# EAGLE design Theremizer (EAGLE 9.5.1)

## Sheet 1 of 3
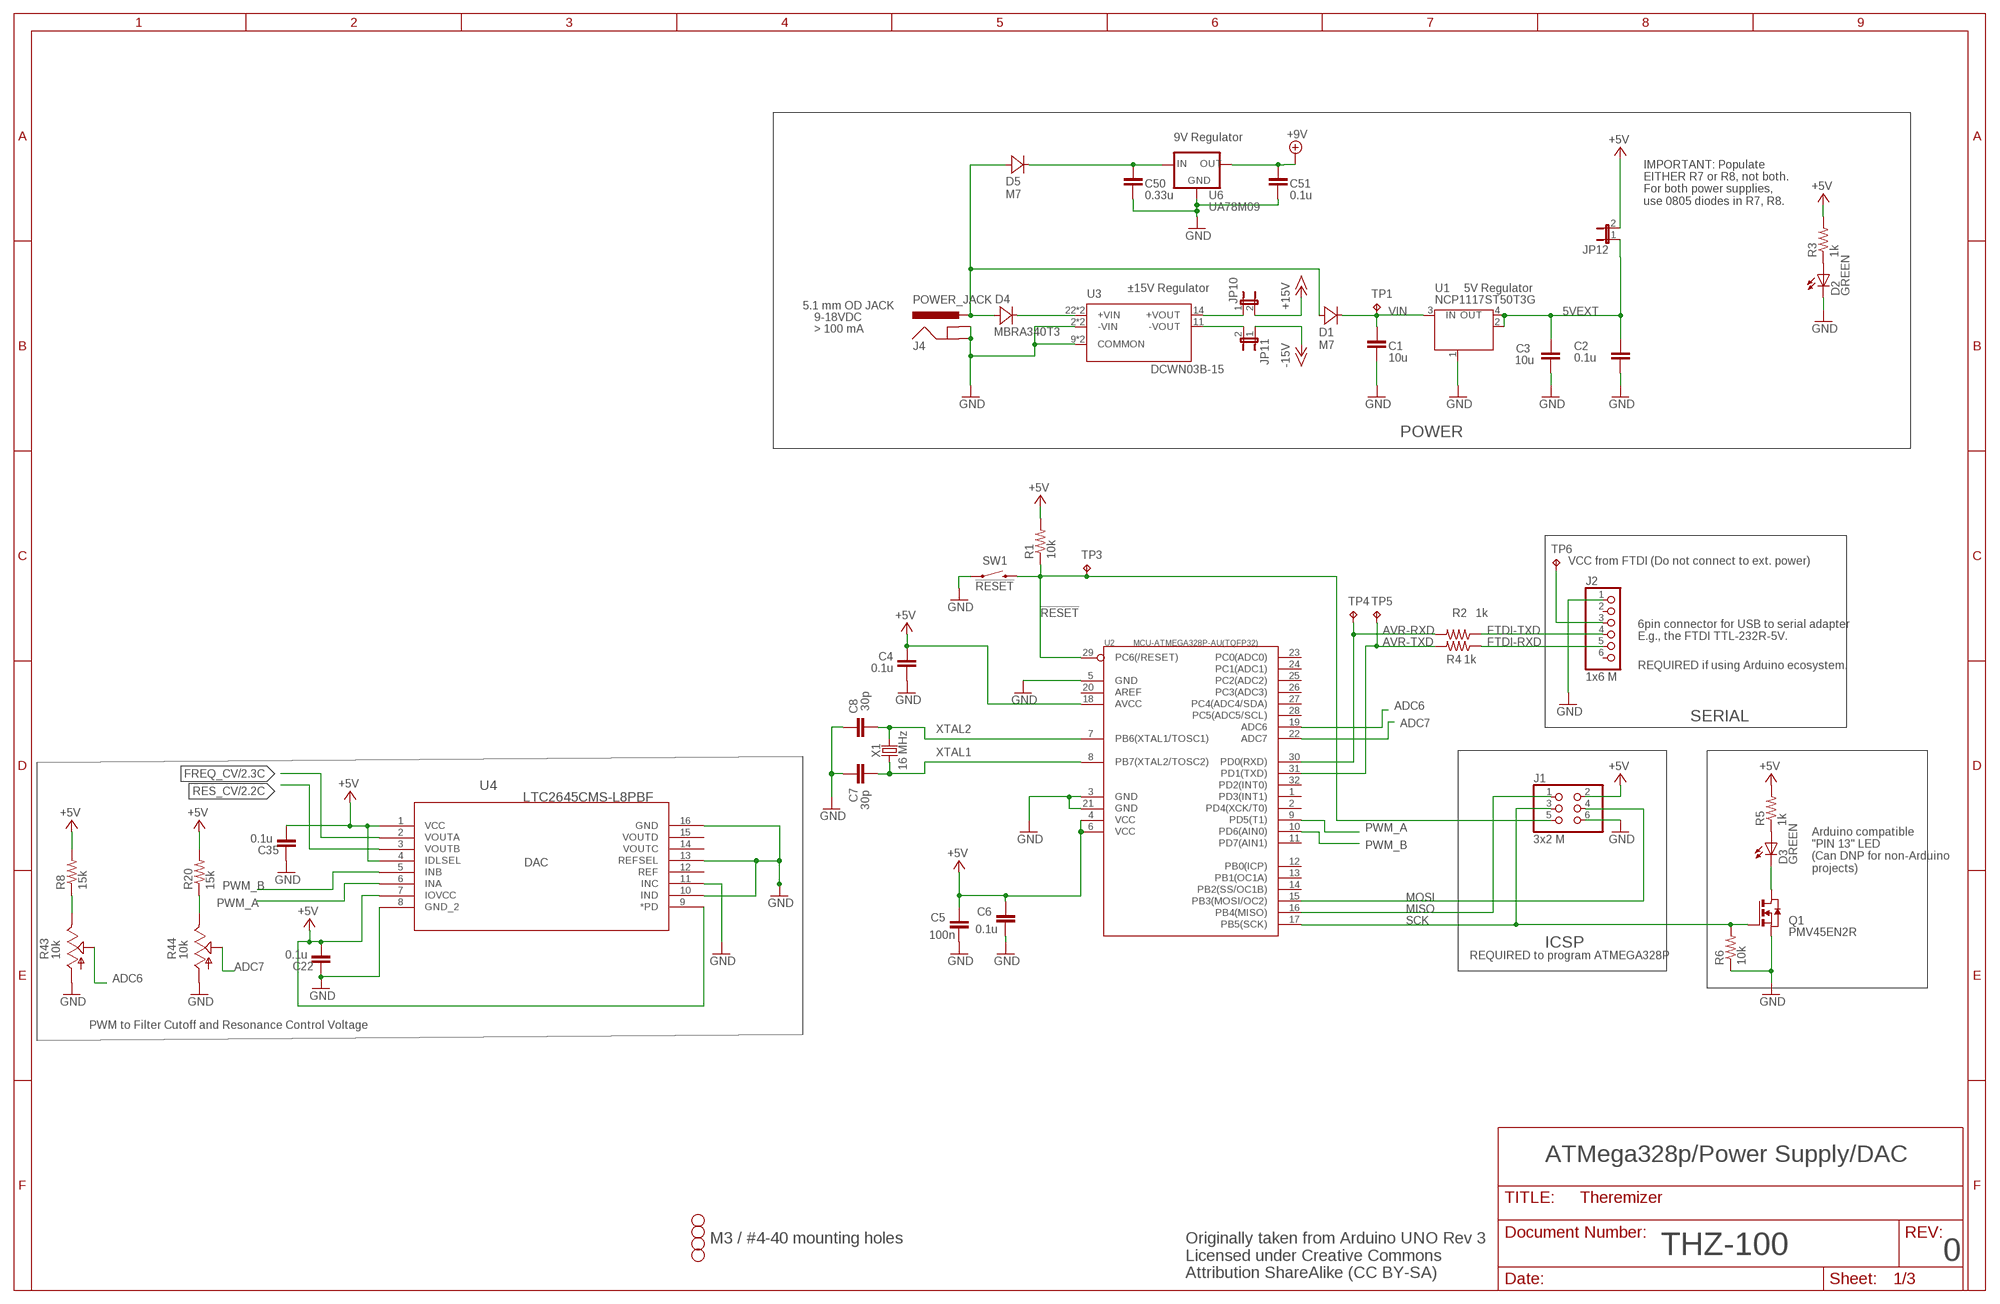
[diagram p0: schematic, sheet 1]

### Parts
C1  10u  C-EUC0805  [C0805]
C2  0.1u  C-EUC0805  [C0805]
C3  10u  C-EUC0805  [C0805]
C4  0.1u  C-EUC0805  [C0805]
C5  100n  C-EUC0805  [C0805]
C6  0.1u  C-EUC0805  [C0805]
C7  30p  C-EUC0805  [C0805]
C8  30p  C-EUC0805  [C0805]
C22  0.1u  C-EUC0805K  [C0805K]
C35  0.1u  C-EUC0805  [C0805]
C50  0.33u  C-EUC0805  [C0805]
C51  0.1u  C-EUC0805  [C0805]
D1  M7  MBRA340T3  [SMA]
D2  GREEN  LEDCHIP-LED0805  [CHIP-LED0805]
D3  GREEN  LEDCHIP-LED0805  [CHIP-LED0805]
D4  MBRA340T3  [SMA]
D5  M7  MBRA340T3  [SMA]
H1  STAND-OFF  [STAND-OFF]
H2  STAND-OFF  [STAND-OFF]
H3  STAND-OFF  [STAND-OFF]
H4  STAND-OFF  [STAND-OFF]
J1  3x2 M  PINHD-2X3  [2X03]
J2  1x6 M  PINHD-1X6  [1X06]
J4  POWER_JACK  [POWER_JACK_PTH]
JP10  JP1E  [JP1]
JP11  JP1E  [JP1]
JP12  JP1E  [JP1]
Q1  PMV45EN2R  NMOSSOT23  [SOT-23]
R1  10k  R-US_R0805  [R0805]
R2  1k  R-US_R0805  [R0805]
R3  1k  R-US_R0805  [R0805]
R4  1k  R-US_R0805  [R0805]
R5  1k  R-US_R0805  [R0805]
R6  10k  R-US_R0805  [R0805]
R8  15k  R-US_R0805  [R0805]
R20  15k  R-US_R0805  [R0805]
R43  10k  TRIM_US-B64Y  [B64Y]
R44  10k  TRIM_US-B64Y  [B64Y]
SW1  !RESET  SWITCH-MOMENTARY-2SMD  [TACTILE_SWITCH_SMD]
TP1  TPPAD1-13  [P1-13]
TP3  TPPAD1-13  [P1-13]
TP4  TPPAD1-13  [P1-13]
TP5  TPPAD1-13  [P1-13]
TP6  TPPAD1-13  [P1-13]
U1  NCP1117ST50T3G  MC33269ST-3.3T3  [SOT223]
U2  MCU-ATMEGA328P-AU(TQFP32)  [TQFP32-0.8-7X7MM]
U3  DCWN03B-15  DCWN03  [DIP1549W45P254L3404H940Q24]
U4  LTC2645CMS-L8PBF  [MSOP-16_MS]
U6  UA78M09  µA78MX  [DPACK]
X1  16 MHz  CRYSTALSMD-HC49UP  [HC49UP]

### Nets
5VEXT [power]: C2.2 C3.1 JP12.1 U1.2(OUT) U1.4(OUT)
!RESET: J1.5 R1.1 SW1.3 TP3.TP U2.29(PC6(/RESET))
+5V [power]: C4.2 C5.2 C6.2 C22.1 C35.1 J1.2 JP12.2 R1.2 R3.2 R5.2 R8.2 R20.2 U2.4(VCC) U2.6(VCC) U2.18(AVCC) U4.1(VCC) U4.4(IDLSEL) U4.7(IOVCC) U4.9(*PD) ; also sheet 2
+9V [power]: C51.1 U6.3(OUT) ; also sheet 3
+15V [power]: JP10.2 ; also sheet 2
-15V [power]: JP11.1 ; also sheet 2
ADC6: R43.S U2.19(ADC6)
ADC7: R44.S U2.22(ADC7)
AVR-RXD: R2.2 TP4.TP U2.30(PD0(RXD))
AVR-TXD: R4.2 TP5.TP U2.31(PD1(TXD))
FREQ_CV: U4.2(VOUTA) ; also sheet 2
FTDI-RXD: J2.5 R4.1
FTDI-TXD: J2.4 R2.1
GND [power]: C1.2 C2.1 C3.2 C4.1 C5.1 C6.1 C7.2 C8.2 C22.2 C35.2 C50.2 C51.2 D2.C J1.6 J2.1 J4.GND J4.GNDBREAK Q1.2(S) R6.1 R43.A R44.A SW1.1 U1.1(GND/ADJ) U2.3(GND) U2.5(GND) U2.21(GND) U3.2(-VIN) U3.3(-VIN) U3.9(COMMON) U3.16(COMMON) U4.8(GND_2) U4.10(IND) U4.11(INC) U4.13(REFSEL) U4.16(GND) U6.4(GND) ; also sheet 2,3
MISO: J1.1 U2.16(PB4(MISO))
MOSI: J1.4 U2.15(PB3(MOSI/OC2))
N$2: D3.A R5.1
N$3 [power]: D2.A R3.1
N$4: D3.C Q1.1(D)
N$5: J2.3 TP6.TP
N$47 [power]: C50.1 D5.C U6.1(IN)
N$51 [power]: D1.A D4.A D5.A J4.PWR
N$54 [power]: D4.C U3.22(+VIN) U3.23(+VIN)
N$55 [power]: JP10.1 U3.14(+VOUT)
N$56 [power]: JP11.2 U3.11(-VOUT)
N$77: R8.1 R43.E
N$78: R20.1 R44.E
PWM_A: U2.9(PD5(T1)) U4.6(INA)
PWM_B: U2.10(PD6(AIN0)) U4.5(INB)
RES_CV: U4.3(VOUTB) ; also sheet 2
SCK: J1.3 Q1.3(G) R6.2 U2.17(PB5(SCK))
VIN [power]: C1.1 D1.C TP1.TP U1.3(IN)
XTAL1: C7.1 U2.8(PB7(XTAL2/TOSC2)) X1.1
XTAL2: C8.1 U2.7(PB6(XTAL1/TOSC1)) X1.2
Unconnected: J2.2 J2.6 U2.1(PD3(INT1)) U2.2(PD4(XCK/T0)) U2.11(PD7(AIN1)) U2.12(PB0(ICP)) U2.13(PB1(OC1A)) U2.14(PB2(SS/OC1B)) U2.20(AREF) U2.23(PC0(ADC0)) U2.24(PC1(ADC1)) U2.25(PC2(ADC2)) U2.26(PC3(ADC3)) U2.27(PC4(ADC4/SDA)) U2.28(PC5(ADC5/SCL)) U2.32(PD2(INT0)) U4.12(REF) U4.14(VOUTC) U4.15(VOUTD)

### Notes on the sheet
- 9V Regulator
- IMPORTANT: Populate 
  EITHER R7 or R8, not both.
  For both power supplies,
  use 0805 diodes in R7, R8.
- ±15V Regulator | 5V Regulator
- 5.1 mm OD JACK
- 9-18VDC
- > 100 mA
- POWER
- VCC from FTDI (Do not connect to ext. power)
- 6pin connector for USB to serial adapter
  E.g., the FTDI TTL-232R-5V.
- REQUIRED if using Arduino ecosystem.
- SERIAL
- DAC
- Arduino compatible
  "PIN 13" LED
  (Can DNP for non-Arduino
  projects)
- ICSP
- REQUIRED to program ATMEGA328P
- PWM to Filter Cutoff and Resonance Control Voltage
- ATMega328p/Power Supply/DAC
- M3 / #4-40 mounting holes
- THZ-100 | 0
- Originally taken from Arduino UNO Rev 3
  Licensed under Creative Commons 
  Attribution ShareAlike (CC BY-SA)

## Sheet 2 of 3
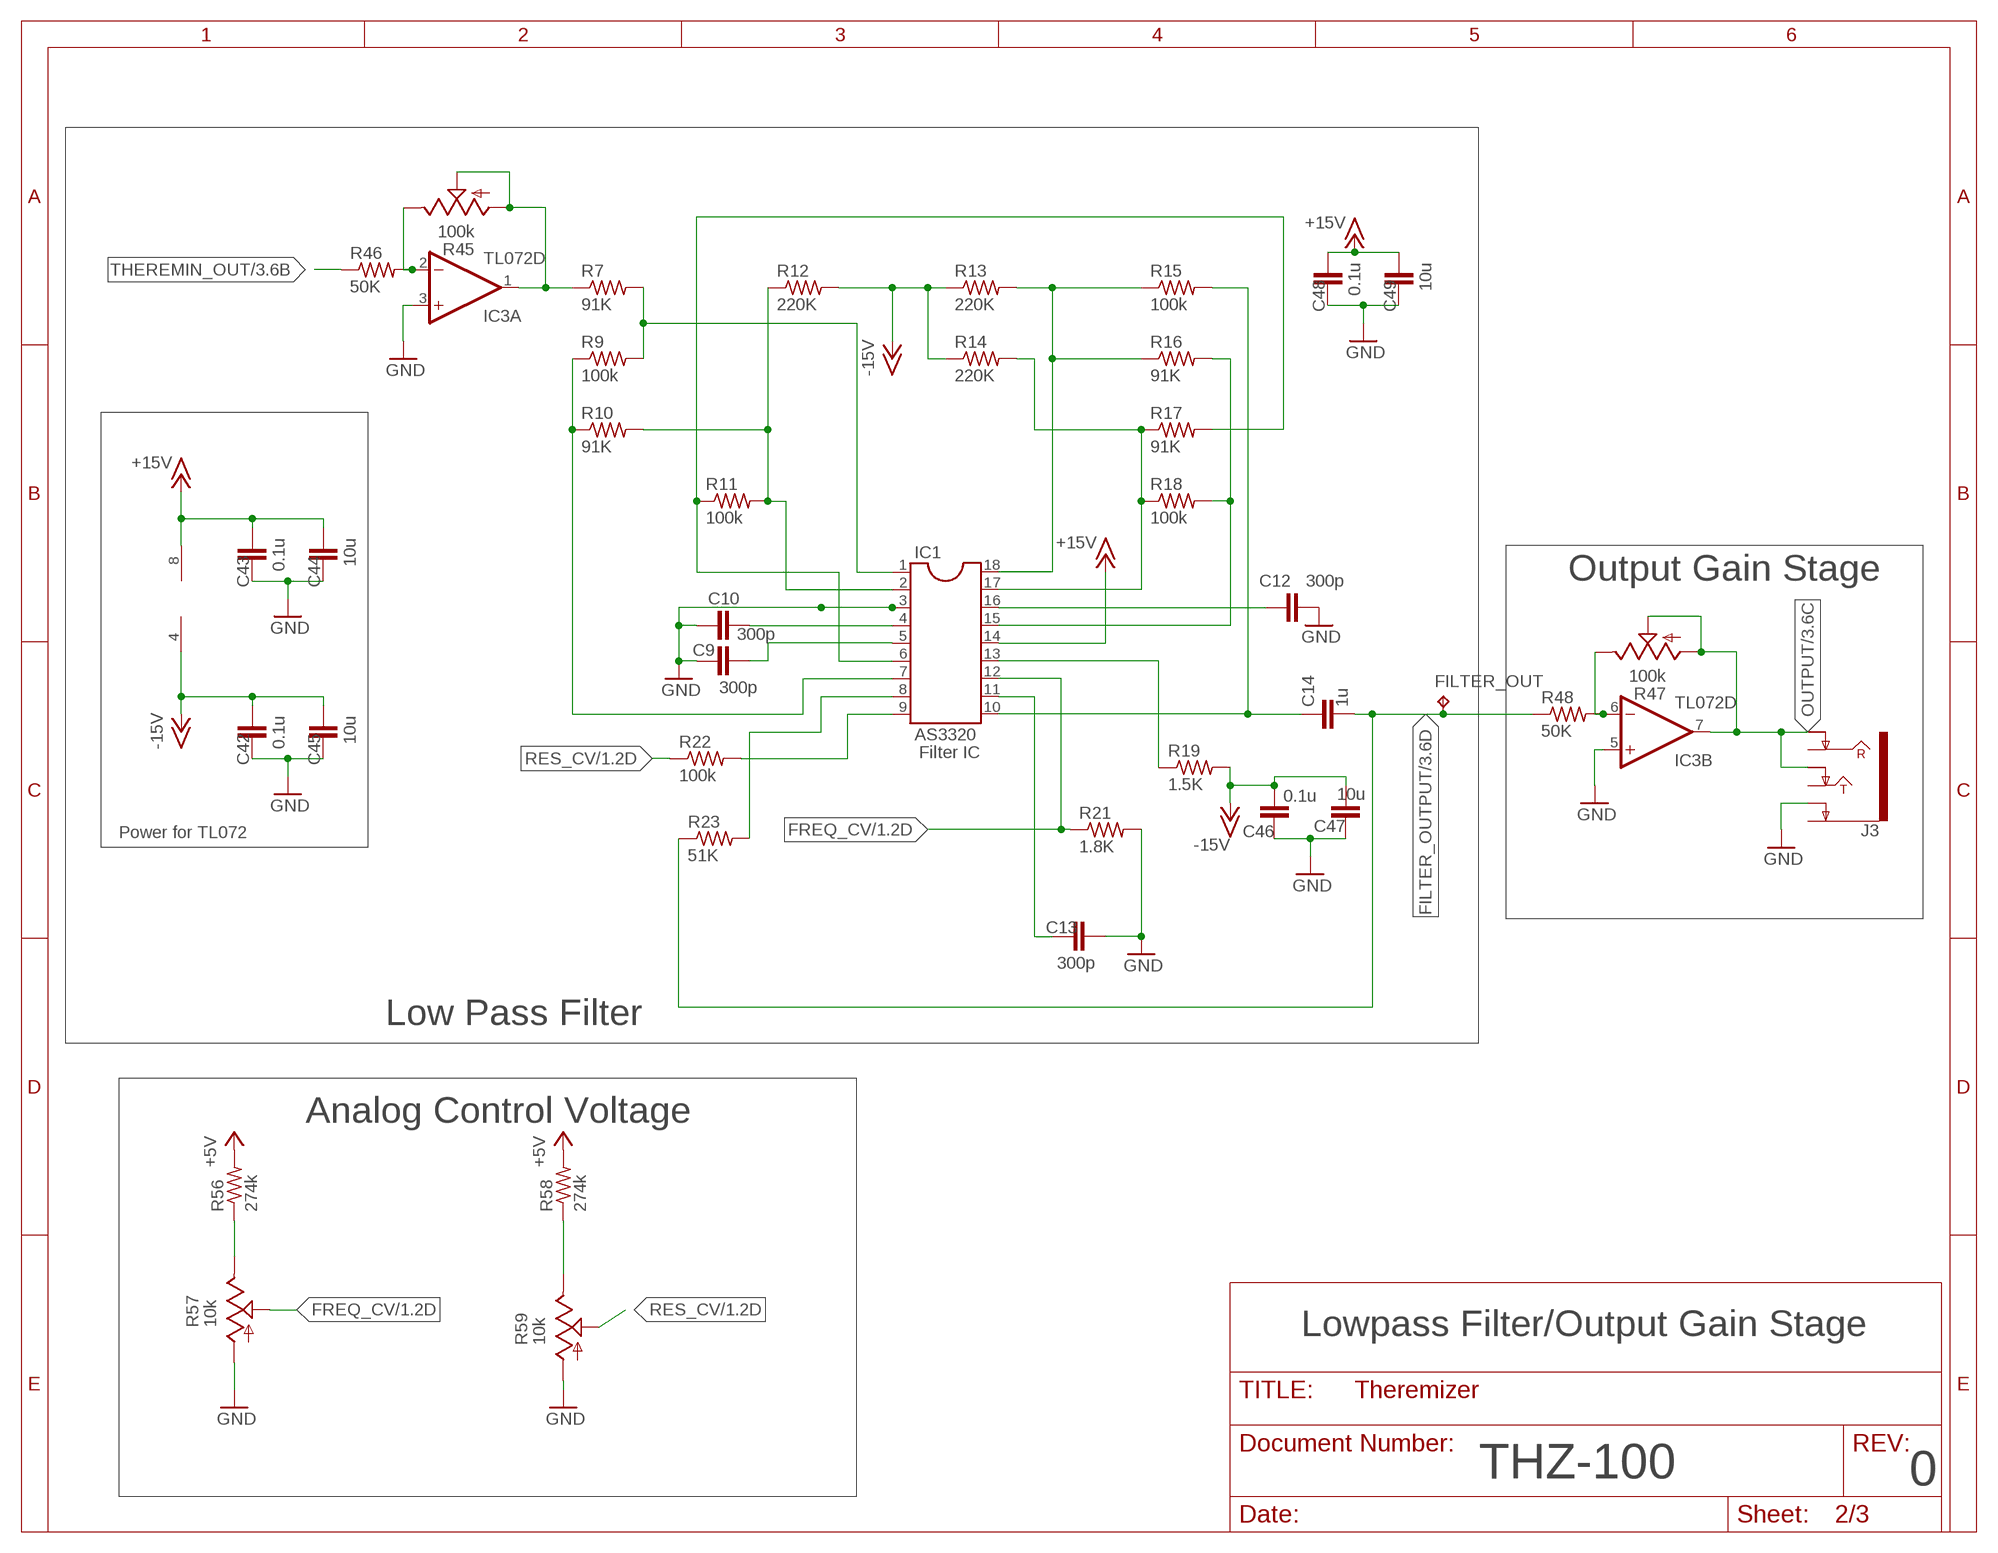
[diagram p1: schematic, sheet 2]

### Parts
C9  300p  C-EUC0805  [C0805]
C10  300p  C-EUC0805  [C0805]
C12  300p  C-EUC0805  [C0805]
C13  300p  C-EUC0805  [C0805]
C14  1u  C-EUC0805  [C0805]
C42  0.1u  C-EUC0805  [C0805]
C43  0.1u  C-EUC0805  [C0805]
C44  10u  C-EUC0805  [C0805]
C45  10u  C-EUC0805  [C0805]
C46  0.1u  C-EUC0805  [C0805]
C47  10u  C-EUC0805  [C0805]
C48  0.1u  C-EUC0805  [C0805]
C49  10u  C-EUC0805  [C0805]
FILTER_OUT  TPB2,54  [B2,54]
IC1  AS3320  DIL18S  [SOCKET-18]
IC3  TL072D  [SO08]
J3  AUDIO_JACK_TRS_0.25"_PTH_RA  [AUDIO_JACK_0.25"_TRS_PTH_RA]
R7  91K  R-US_R0805  [R0805]
R9  100k  R-US_R0805  [R0805]
R10  91K  R-US_R0805  [R0805]
R11  100k  R-US_R0805  [R0805]
R12  220K  R-US_R0805  [R0805]
R13  220K  R-US_R0805  [R0805]
R14  220K  R-US_R0805  [R0805]
R15  100k  R-US_R0805  [R0805]
R16  91K  R-US_R0805  [R0805]
R17  91K  R-US_R0805  [R0805]
R18  100k  R-US_R0805  [R0805]
R19  1.5K  R-US_R0805  [R0805]
R21  1.8K  R-US_R0805  [R0805]
R22  100k  R-US_R0805  [R0805]
R23  51K  R-US_R0805  [R0805]
R45  100k  TRIM_US-B64Y  [B64Y]
R46  50K  R-US_R0805  [R0805]
R47  100k  TRIM_US-B64Y  [B64Y]
R48  50K  R-US_R0805  [R0805]
R56  274k  R-US_R0805  [R0805]
R57  10k  TRIM_US-B64Y  [B64Y]
R58  274k  R-US_R0805  [R0805]
R59  10k  TRIM_US-B64Y  [B64Y]

### Nets
+5V [power]: R56.2 R58.2 ; also sheet 1
+15V [power]: C43.2 C44.2 C48.2 C49.2 IC1.14 IC3.8(P:V+) ; also sheet 1
-15V [power]: C42.2 C45.2 C46.2 C47.2 IC3.4(P:V-) R12.2 R13.1 R14.1 R19.2 ; also sheet 1
FILTER_OUTPUT: C14.2 FILTER_OUT.TP R23.1 R48.1 ; also sheet 3
FREQ_CV: IC1.12 R21.1 R57.S ; also sheet 1
GND [power]: C9.1 C10.1 C12.2 C13.2 C42.1 C43.1 C44.1 C45.1 C46.1 C47.1 C48.1 C49.1 IC1.3 IC3.3(A:+IN) IC3.5(B:+IN) J3.SLEEVE-NORM(EARTH-NORM) R21.2 R57.A R59.A ; also sheet 1,3
N$6: IC1.1 R7.2 R9.2
N$7: IC1.7 R9.1 R10.1
N$8: C9.2 IC1.5
N$9: C10.2 IC1.4
N$10: IC1.2 R10.2 R11.2 R12.1
N$11: IC1.6 R11.1 R17.2
N$12: C14.1 IC1.10 R15.2
N$13: IC1.18 R13.2 R15.1 R16.1
N$14: IC1.17 R14.2 R17.1 R18.1
N$15: IC1.15 R16.2 R18.2
N$16: C12.1 IC1.16
N$17: IC1.13 R19.1
N$18: C13.1 IC1.11
N$19: IC3.2(A:-IN) R45.E R46.2
N$20: IC1.8 R23.2
N$21: IC1.9 R22.2
N$32: R56.1 R57.E
N$50: IC3.1(A:OUT) R7.1 R45.A R45.S
N$52: IC3.6(B:-IN) R47.E R48.2
N$65: R58.1 R59.E
OUTPUT: IC3.7(B:OUT) J3.RING-NORM J3.TIP-NORM R47.A R47.S ; also sheet 3
RES_CV: R22.1 R59.S ; also sheet 1
THEREMIN_OUT: R46.1 ; also sheet 3
Unconnected: J3.RING J3.SLEEVE(EARTH) J3.TIP

### Notes on the sheet
- Output Gain Stage
- Filter IC
- Power for TL072
- Low Pass Filter
- Analog Control Voltage
- Lowpass Filter/Output Gain Stage
- THZ-100 | 0

## Sheet 3 of 3
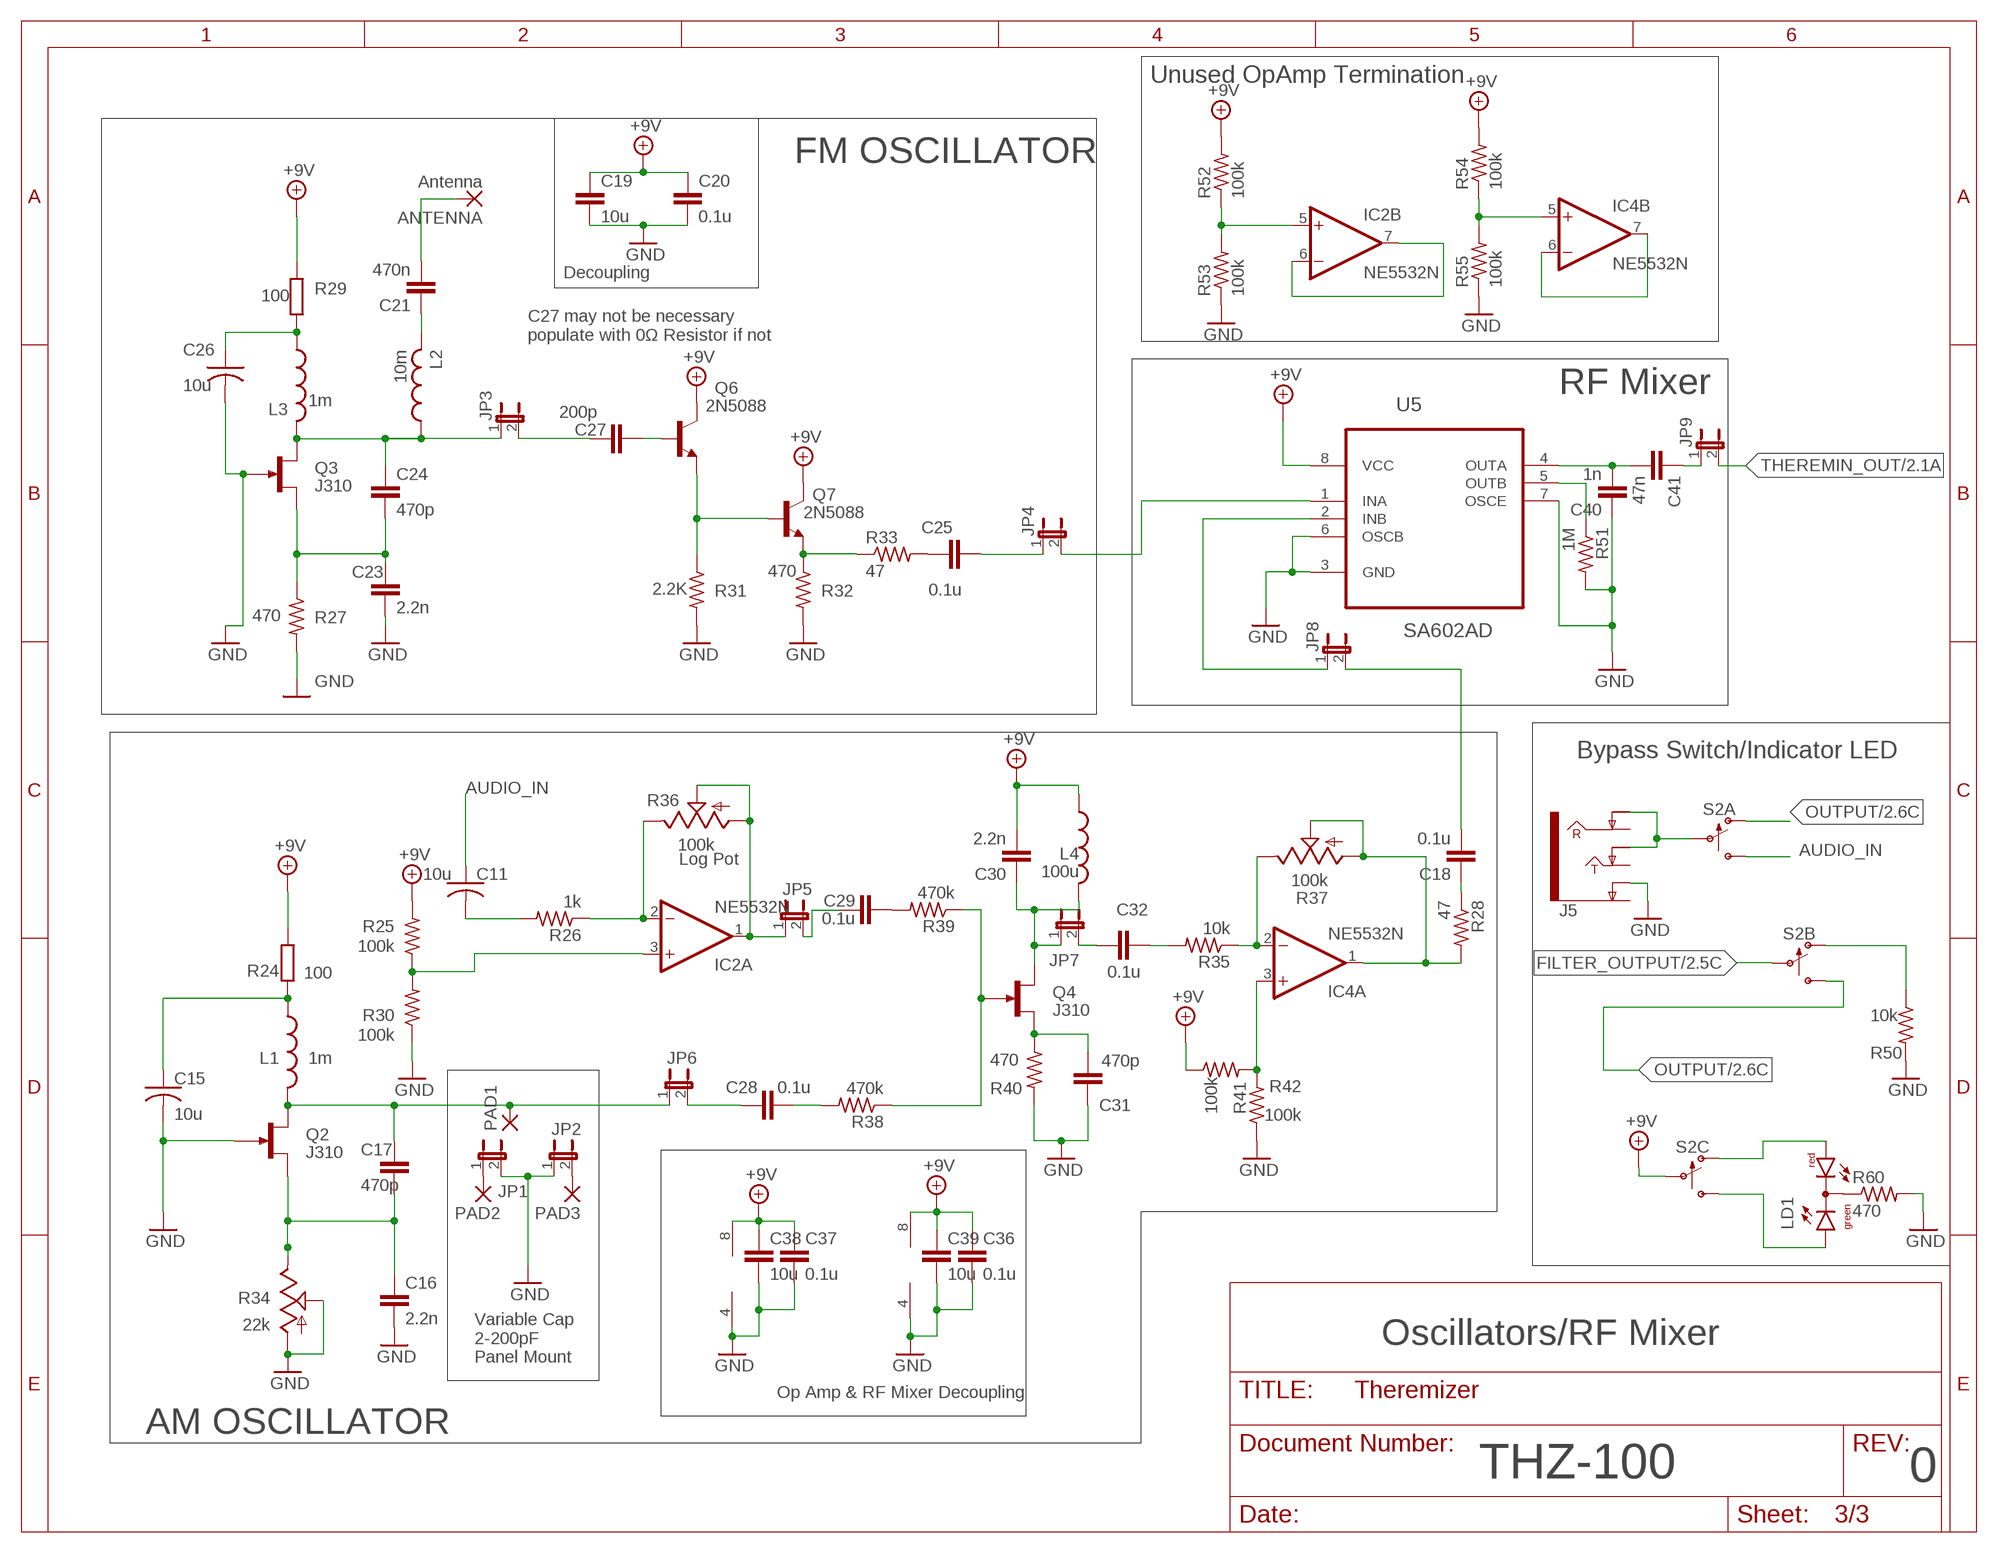
[diagram p2: schematic, sheet 3]

### Parts
ANTENNA  Antenna  2,54/1,1  [2,54/1,1]
C11  10u  C-US050-025X075  [C050-025X075]
C15  10u  C-US050-025X075  [C050-025X075]
C16  2.2n  C-EUC0805  [C0805]
C17  470p  C-EUC0805  [C0805]
C18  0.1u  C-EUC0805  [C0805]
C19  10u  C-EUC0805  [C0805]
C20  0.1u  C-EUC0805  [C0805]
C21  470n  C-EUC0805  [C0805]
C23  2.2n  C-EUC0805  [C0805]
C24  470p  C-EUC0805  [C0805]
C25  0.1u  C-EUC0805  [C0805]
C26  10u  C-US050-025X075  [C050-025X075]
C27  200p  C-EUC0805  [C0805]
C28  0.1u  C-EUC0805  [C0805]
C29  0.1u  C-EUC0805  [C0805]
C30  2.2n  C-EUC0805  [C0805]
C31  470p  C-EUC0805  [C0805]
C32  0.1u  C-EUC0805  [C0805]
C36  0.1u  C-EUC0805  [C0805]
C37  0.1u  C-EUC0805  [C0805]
C38  10u  C-EUC0805  [C0805]
C39  10u  C-EUC0805  [C0805]
C40  1n  C-EUC0805  [C0805]
C41  47n  C-EUC0805  [C0805]
IC2  NE5532N  [DIL08]
IC4  NE5532N  [DIL08]
J5  AUDIO_JACK_TRS_0.25"_PTH_RA  [AUDIO_JACK_0.25"_TRS_PTH_RA]
JP1  JP1E  [JP1]
JP2  JP1E  [JP1]
JP3  JP1E  [JP1]
JP4  JP1E  [JP1]
JP5  JP1E  [JP1]
JP6  JP1E  [JP1]
JP7  JP1E  [JP1]
JP8  JP1E  [JP1]
JP9  JP1E  [JP1]
L1  1m  L-US6000-XXX-RC  [6000-XXXX-RC]
L2  10m  L-US6000-XXX-RC  [6000-XXXX-RC]
L3  1m  L-US6000-XXX-RC  [6000-XXXX-RC]
L4  100u  L-US6000-XXX-RC  [6000-XXXX-RC]
LD1  DUOLED-RG-C  [DUOLED-C-5MM]
PAD1  2,15/1,0  [2,15/1,0]
PAD2  2,15/1,0  [2,15/1,0]
PAD3  2,15/1,0  [2,15/1,0]
Q2  J310  [TO92R]
Q3  J310  [TO92R]
Q4  J310  [TO92R]
Q6  2N5088  [TO92]
Q7  2N5088  [TO92]
R24  100  R-EU_PRL1632  [PRL1632]
R25  100k  R-US_R0805  [R0805]
R26  1k  R-US_R0805  [R0805]
R27  470  R-US_R0805  [R0805]
R28  47  R-US_R0805  [R0805]
R29  100  R-EU_PRL1632  [PRL1632]
R30  100k  R-US_R0805  [R0805]
R31  2.2K  R-US_R0805  [R0805]
R32  470  R-US_R0805  [R0805]
R33  47  R-US_R0805  [R0805]
R34  22k  TRIM_US-B64Y  [B64Y]
R35  10k  R-US_R0805  [R0805]
R36  100k  TRIM_US-B64Y  [B64Y]
R37  100k  TRIM_US-B64Y  [B64Y]
R38  470k  R-US_R0805  [R0805]
R39  470k  R-US_R0805  [R0805]
R40  470  R-US_R0805  [R0805]
R41  100k  R-US_R0805  [R0805]
R42  100k  R-US_R0805  [R0805]
R50  10k  R-US_R0805  [R0805]
R51  1M  R-US_R0805  [R0805]
R52  100k  R-US_R0805  [R0805]
R53  100k  R-US_R0805  [R0805]
R54  100k  R-US_R0805  [R0805]
R55  100k  R-US_R0805  [R0805]
R60  470  R-US_R0805  [R0805]
S2  SWITCH-3PDT-PTH-STOMP  [STOMP_SWITCH_3PDT]
U5  SA602AD  [SO8]

### Nets
+9V [power]: C19.1 C20.1 C30.2 C36.1 C37.1 C38.1 C39.1 IC2.8(P:V+) IC4.8(P:V+) L4.1 Q6.1(C) Q7.1(C) R24.2 R25.2 R29.1 R41.1 R52.2 R54.2 S2.P$8(C:P) U5.8(VCC) ; also sheet 1
ANTENNA: ANTENNA.1(P) C21.2
AUDIO_IN: C11.1 S2.P$3(A:S)
FILTER_OUTPUT: S2.P$5(B:P) ; also sheet 2
GND [power]: C15.2 C16.2 C19.2 C20.2 C23.2 C26.2 C31.1 C36.2 C37.2 C38.2 C39.2 C40.1 IC2.4(P:V-) IC4.4(P:V-) J5.SLEEVE-NORM(EARTH-NORM) JP1.2 JP2.1 Q2.G Q3.G R27.2 R30.1 R31.2 R32.2 R34.A R34.S R40.2 R42.1 R50.2 R51.2 R53.1 R55.1 R60.2 U5.3(GND) U5.6(OSCB) U5.7(OSCE) ; also sheet 1,2
N$1: C21.1 L2.2
N$22: C15.1 L1.1 R24.1
N$23: C18.1 R28.1
N$24: JP4.2 U5.1(INA)
N$25: C25.1 R33.2
N$26: C24.1 JP3.1 L2.1 L3.2 Q3.D
N$27: C27.2 Q6.2(B)
N$28: IC2.3(A:+IN) R25.1 R30.2
N$29: IC4.3(A:+IN) R41.2 R42.2
N$30: Q6.3(E) Q7.2(B) R31.1
N$31: Q7.3(E) R32.1 R33.1
N$33: C32.1 R35.2
N$34: C16.1 C17.2 Q2.S R34.E
N$35: C17.1 JP6.1 L1.2 PAD1.1(P) Q2.D
N$36: JP8.1 U5.2(INB)
N$37: J5.RING-NORM J5.TIP-NORM S2.P$2(A:P)
N$38: R50.1 S2.P$4(B:O)
N$39: C11.2 R26.2
N$40: IC2.2(A:-IN) R26.1 R36.E
N$41: IC2.1(A:OUT) JP5.1 R36.A R36.S
N$42: C29.2 R39.2
N$43: C28.2 R38.2
N$44: Q4.G R38.1 R39.1
N$45: C30.1 JP7.1 L4.2 Q4.D
N$46: C31.2 Q4.S R40.1
N$48: IC4.2(A:-IN) R35.1 R37.E
N$49: IC4.1(A:OUT) R28.2 R37.A R37.S
N$53: LD1.AR S2.P$7(C:O)
N$57: C26.1 L3.1 R29.2
N$58: LD1.AX(AG) S2.P$9(C:S)
N$59: R51.1 U5.5(OUTB)
N$60: IC2.6(B:-IN) IC2.7(B:OUT)
N$61: IC2.5(B:+IN) R52.1 R53.2
N$62: IC4.5(B:+IN) R54.1 R55.2
N$63: IC4.6(B:-IN) IC4.7(B:OUT)
N$64: C23.1 C24.2 Q3.S R27.1
N$66: JP1.1 PAD2.1(P)
N$67: JP2.2 PAD3.1(P)
N$69: C27.1 JP3.2
N$70: C25.2 JP4.1
N$71: C29.1 JP5.2
N$72: C28.1 JP6.2
N$73: C32.2 JP7.2
N$74: C18.2 JP8.2
N$75: C40.2 C41.2 U5.4(OUTA)
N$76: LD1.C R60.1
N$79: C41.1 JP9.1
OUTPUT: S2.P$1(A:O) S2.P$6(B:S) ; also sheet 2
THEREMIN_OUT: JP9.2 ; also sheet 2
Unconnected: J5.RING J5.SLEEVE(EARTH) J5.TIP

### Notes on the sheet
- Unused OpAmp Termination
- FM OSCILLATOR
- Decoupling
- C27 may not be necessary 
  populate with 0Ω Resistor if not
- RF Mixer
- Bypass Switch/Indicator LED
- Log Pot
- Oscillators/RF Mixer
- Variable Cap 
  2-200pF
  Panel Mount
- Op Amp & RF Mixer Decoupling
- AM OSCILLATOR
- THZ-100 | 0

## Library data of the parts
ANTENNA = wirepad:2,54/1,1: THROUGH-HOLE PAD
C1 C3 C50 C51 = rcl:C-EU: CAPACITOR, European symbol; MFR: Samsung; MPN: CL21A106KOQNNNG; SPICEPREFIX: C
C2 C4-C6 = rcl:C-EU: CAPACITOR, European symbol; MFR: Samsung; MPN: CL21B104KBCNNNC; SPICEPREFIX: C
C7 = rcl:C-EU: CAPACITOR, European symbol; DESC: CAP CER 30PF 50V C0G/NP0 0805; MFR: Samsung; MPN: CL21C180JBANNNC; SPICEPREFIX: C
C8 C22 C35 = rcl:C-EU: CAPACITOR, European symbol; DESC: CAP CER 30PF 50V C0G/NP0 0805; MFR: Samsung; MPN: CL21C300JBANNNC; SPICEPREFIX: C
C9 C10 C12-C14 C16-C21 C23-C25 C27-C32 C36-C49 = rcl:C-EU: CAPACITOR, European symbol; SPICEPREFIX: C
C11 C15 C26 = rcl:C-US: CAPACITOR, American symbol; SPICEPREFIX: C
D1 D5 = diode:MBRA340T3: Surface Mount Schottky Power Rectifier Source: http://www.onsemi.com/pub_link/Collateral/MBRA340T3-D.PDF; MFR: SMC Diode; MPN: 10BQ030TR
D2 D3 = led:LED: LED OSRAM: - CHIPLED LG R971, LG N971, LY N971, LG Q971, LY Q971, LO R971, LY R971 LH N974, LH R974 LS Q976, LO Q976, LY Q976 LO Q996 - Hyper CHIPLED LW Q18S LB Q993, LB Q99A, LB R99A - SideLED LS A670, LO A670, LY A670, LG A670, LP A670 LB A673, LV A673, LT A673, LW A673 LH A674 LY A675 LS A676, LA A676, LO A676, LY A676, LW A676 LS A679, LY A679, LG A679 - Hyper Micro SIDELED® LS Y876, LA Y876, LO Y876, LY Y876 LT Y87S - SmartLED LW L88C, LW L88S LB L89C, LB L89S, LG L890 LS L89K, LO L89K, LY L89K LS L896, LA L896, LO L896, LY L896 - TOPLED LS T670, LO T670, LY T670, LG T670, LP T670 LSG T670, LSP T670, LSY T670, LOP T670, LYG T670 LG T671, LOG T671, LSG T671 LB T673, LV T673, LT T673, LW T673 LH T674 LS T676, LA T676, LO T676, LY T676, LB T676, LH T676, LSB T676, LW T676 LB T67C, LV T67C, LT T67C, LS T67K, LO T67K, LY T67K, LW E67C LS E67B, LA E67B, LO E67B, LY E67B, LB E67C, LV E67C, LT E67C LW T67C LS T679, LY T679, LG T679 LS T770, LO T770, LY T770, LG T770, LP T770 LB T773, LV T773, LT T773, LW T773 LH T774 LS E675, LA E675, LY E675, LS T675 LS T776, LA T776, LO T776, LY T776, LB T776 LHGB T686 LT T68C, LB T68C - Hyper Mini TOPLED® LB M676 - Mini TOPLED Santana® LG M470 LS M47K, LO M47K, LY M47K Source: http://www.osram.convergy.de LUXEON: - LUMILED® LXK2-PW12-R00, LXK2-PW12-S00, LXK2-PW14-U00, LXK2-PW14-V00 LXK2-PM12-R00, LXK2-PM12-S00, LXK2-PM14-U00 LXK2-PE12-Q00, LXK2-PE12-R00, LXK2-PE12-S00, LXK2-PE14-T00, LXK2-PE14-U00 LXK2-PB12-K00, LXK2-PB12-L00, LXK2-PB12-M00, LXK2-PB14-N00, LXK2-PB14-P00, LXK2-PB14-Q00 LXK2-PR12-L00, LXK2-PR12-M00, LXK2-PR14-Q00, LXK2-PR14-R00 LXK2-PD12-Q00, LXK2-PD12-R00, LXK2-PD12-S00 LXK2-PH12-R00, LXK2-PH12-S00 LXK2-PL12-P00, LXK2-PL12-Q00, LXK2-PL12-R00 Source: www.luxeon.com KINGBRIGHT: KA-3528ASYC Source: www.kingbright.com; MFR: Würth Elektronik; MPN: 150080GS75000
D4 = diode:MBRA340T3: Surface Mount Schottky Power Rectifier Source: http://www.onsemi.com/pub_link/Collateral/MBRA340T3-D.PDF
FILTER_OUT TP1 TP3-TP6 = testpad:TP: Test pad
H1-H4 = SparkFun-Hardware:STAND-OFF: Stand Off Drill holes for mechanically mounting via screws, standoffs, etc. Note: Use the keepout ring to avoid running the screw head into surrounding components. Variant Overviews STAND-OFF - Mechanical footprint for a #4 phillips button head screw. STAND-OFF-TIGHT - Mechanical footprint for a #4 phillips button head screw, Example SparkFun Products Screw - Phillips Head (1/4", 4-40, 10 pack) <https://www.sparkfun.com/products/10453> (PRT-10453) Screw - Phillips Head (1/2", 4-40, 10 pack) <https://www.sparkfun.com/products/10452> (PRT-10452) Screw - Phillips Head (3/4", 4-40, 10 pack) <https://www.sparkfun.com/products/10451> (PRT-10451) Screw - Phillips Head (1", 4-40, 10 pack) <https://www.sparkfun.com/products/10450> (PRT-10450)
IC1 = ic-package:DIL18: Dual In Line / Socket
IC2 IC4 = linear:NE5532: AUDIO AMPLIFIER
IC3 = linear:TL072: OP AMP
J1 = SmartPrj:PINHD-2X3: PIN HEADER; MFR: Harwin; MPN: M20-9980345
J2 = pinhead:PINHD-1X6: PIN HEADER; MFR: Sullins; MPN: PRPC006SAAN-RC
J3 J5 = SparkFun-Connectors:AUDIO_JACK_TRS_0.25"_PTH_RA: Audio Jack, 1/4" TRS jack, horizontal, PTH, aka "Phono jack" Find the connector here: Audio Jack - 1/4" Stereo (right angle) <https://www.sparkfun.com/products/11144> (COM-11144) Datasheet <http://cdn.sparkfun.com/datasheets/Components/General/JP-611%20DD.jpg> Note, although the datasheet and physical part are slightly different, this footprint was proven to mate well on the Proto Pedal. This device is used on these SparkFun Products: SparkFun TRS Jack Breakout - 1/4" Stereo <https://www.sparkfun.com/products/13005> (BOB-13005 ) SparkFun Proto Pedal - sorry bad link - product comming soon! <https://www.sparkfun.com/products/13124> (PRT-13124); PROD_ID: CONN-12339; SF_ID: COM-11144
J4 = SparkFun-Connectors:POWER_JACK: Power Jack Connector This is the standard 5.5mm barrel jack for power. The PTH is the most common, proven, reliable, footprint. The Slot footprint only works if the mill layer is transmitted to the PCB fab house so be warned. Here are the connectors we sell at SparkFun: DC Barrel Power Jack/Connector <https://www.sparkfun.com/products/119> (PRT-00119) DC Barrel Power Jack/Connector (SMD) <https://www.sparkfun.com/products/12748> (PRT-12748) DC Barrel Jack Adapter - Breadboard Compatible <https://www.sparkfun.com/products/10811> (PRT-10811) It is used on this SparkFun product (and many, many others): SparkFun RedBoard - Programmed with Arduino <https://www.sparkfun.com/products/12757> (DEV-12757) Also, if you need a mating power supply or connector, please check these out: Wall Adapter Power Supply - 9VDC 650mA <https://www.sparkfun.com/products/298> (TOL-00298) DC Barrel Jack Adapter - Male <https://www.sparkfun.com/products/10287> (PRT-10287); MFR: CUI; MPN: PJ-202A; PROD_ID: CONN-08197
JP1-JP12 = jumper:JP1E: JUMPER
L1-L4 = rcl:L-US: INDUCTOR, American symbol; SPICEPREFIX: L
LD1 = led:DUOLED-RG-C: DUO LED 2 colors (red/green), 5 mm, round, common Cathode www.ligitek.com or other producers.
PAD1-PAD3 = wirepad:2,15/1,0: THROUGH-HOLE PAD
Q1 = zetex:NMOSSOT23: MOS FET; MFR: Nexperia; MPN: PMV45EN2R; OC_FARNELL: unknown; OC_NEWARK: unknown
Q2-Q4 = transistor-small-signal:J310: N-Channel RF Amplifier J309, J310 Source: http://www.fairchildsemi.com/pf/J3/J310.html
Q6 Q7 = transistor-npn:2N5088: NPN Transistor
R1 R6 R8 R20 = rcl:R-US_: RESISTOR, American symbol; MFR: Yageo; MPN: RC0805FR-0710KL; SPICEPREFIX: R
R2-R5 = rcl:R-US_: RESISTOR, American symbol; MFR: Yageo; MPN: RC0805FR-071KL; SPICEPREFIX: R
R7 R9-R19 R21-R23 R25-R28 R30-R33 R35 R38-R42 R46 R48 R50-R56 R58 R60 = rcl:R-US_: RESISTOR, American symbol; SPICEPREFIX: R
R24 R29 = rcl:R-EU_: RESISTOR, European symbol; SPICEPREFIX: R
R34 R36 R37 R43-R45 R47 R57 R59 = pot:TRIM_US-: POTENTIOMETER
S2 = SparkFun-Switches:SWITCH-3PDT: 3-Pole, Double-Throw (3PDT) Switch Three-pole, double-throw stomp switch. Drawn as three separate gates for schematic clarity. SparkFun Products Used in SparkFun Proto Pedal <https://www.sparkfun.com/products/13124> (PRT-13124); PROD_ID: SWCH-13197
SW1 = SparkFun-Electromechanical:SWITCH-MOMENTARY-2: Various NO switches- pushbuttons, reed, etc; DESC: SWITCH TACTILE SPST-NO 0.05A 12V; MFR: C&K; MPN: RS-187R05A2-DS MT RT
U1 = linear:MC33269ST*: Adjustable Output Low Dropout Voltage Regulator 800 mA Source: http://www.onsemi.com/pub/Collateral/MC33269-D.PDF; MFR: ON Semiconductor; MPN: NCP1117ST50T3G
U2 = MCU-ATMEGA328P-AU_TQFP32_:MCU-ATMEGA328P-AU(TQFP32): 310010049; DESCRIPTION: Microcontroller Mcu, 8 Bit, Atmega, 20mhz, Tqfp-32; DIGI-KEY_PART_NUMBER: ATMEGA328P-AU-ND; DIGI-KEY_PURCHASE_URL: https://www.digikey.com/product-detail/en/microchip-technology/ATMEGA328P-AU/ATMEGA328P-AU-ND/1832260?utm_source=snapeda&utm_medium=aggregator&utm_campaign=symbol; MF: Microchip; MP: ATMEGA328P-AU; PACKAGE: TQFP-32 Microchip
U3 = DIP1549W45P254L3404H940Q24:DCWN03: DCWN03 and SCWN03 series are 3W isolated and regulated module type DC to DC converter with DIP24 package.
U4 = LTC2645CMS-L8PBF:LTC2645CMS-L8PBF; AVAILABILITY: Unavailable; DESCRIPTION: LTC2645 - Quad 12-/10-/8-Bit PWM to VOUT DACs with 10ppm/°C Reference; MF: Linear Technology/Analog; MP: LTC2645CMS-L8#PBF; PACKAGE: MSOP-16 Linear Technology; PRICE: None
U5 = SA602AN:SA602AD
U6 = uA78Mx:µA78MX
X1 = SparkFun-Clocks:CRYSTAL: Crystals (Generic) These are passive quartz crystals, which can be used as a clock source for a microcontroller. Crystal's are two-terminal devices. They require external "load" capacitors to generate an oscillating signal.; DESC: CRYSTAL 16.000 MHZ 18PF SMD; MFR: ECS; MPN: ECS-160-18-5PX-TR

## Net classes
0 default: width 0.254 mm, clearance 0.152 mm
1 power: width 1 mm

## Board
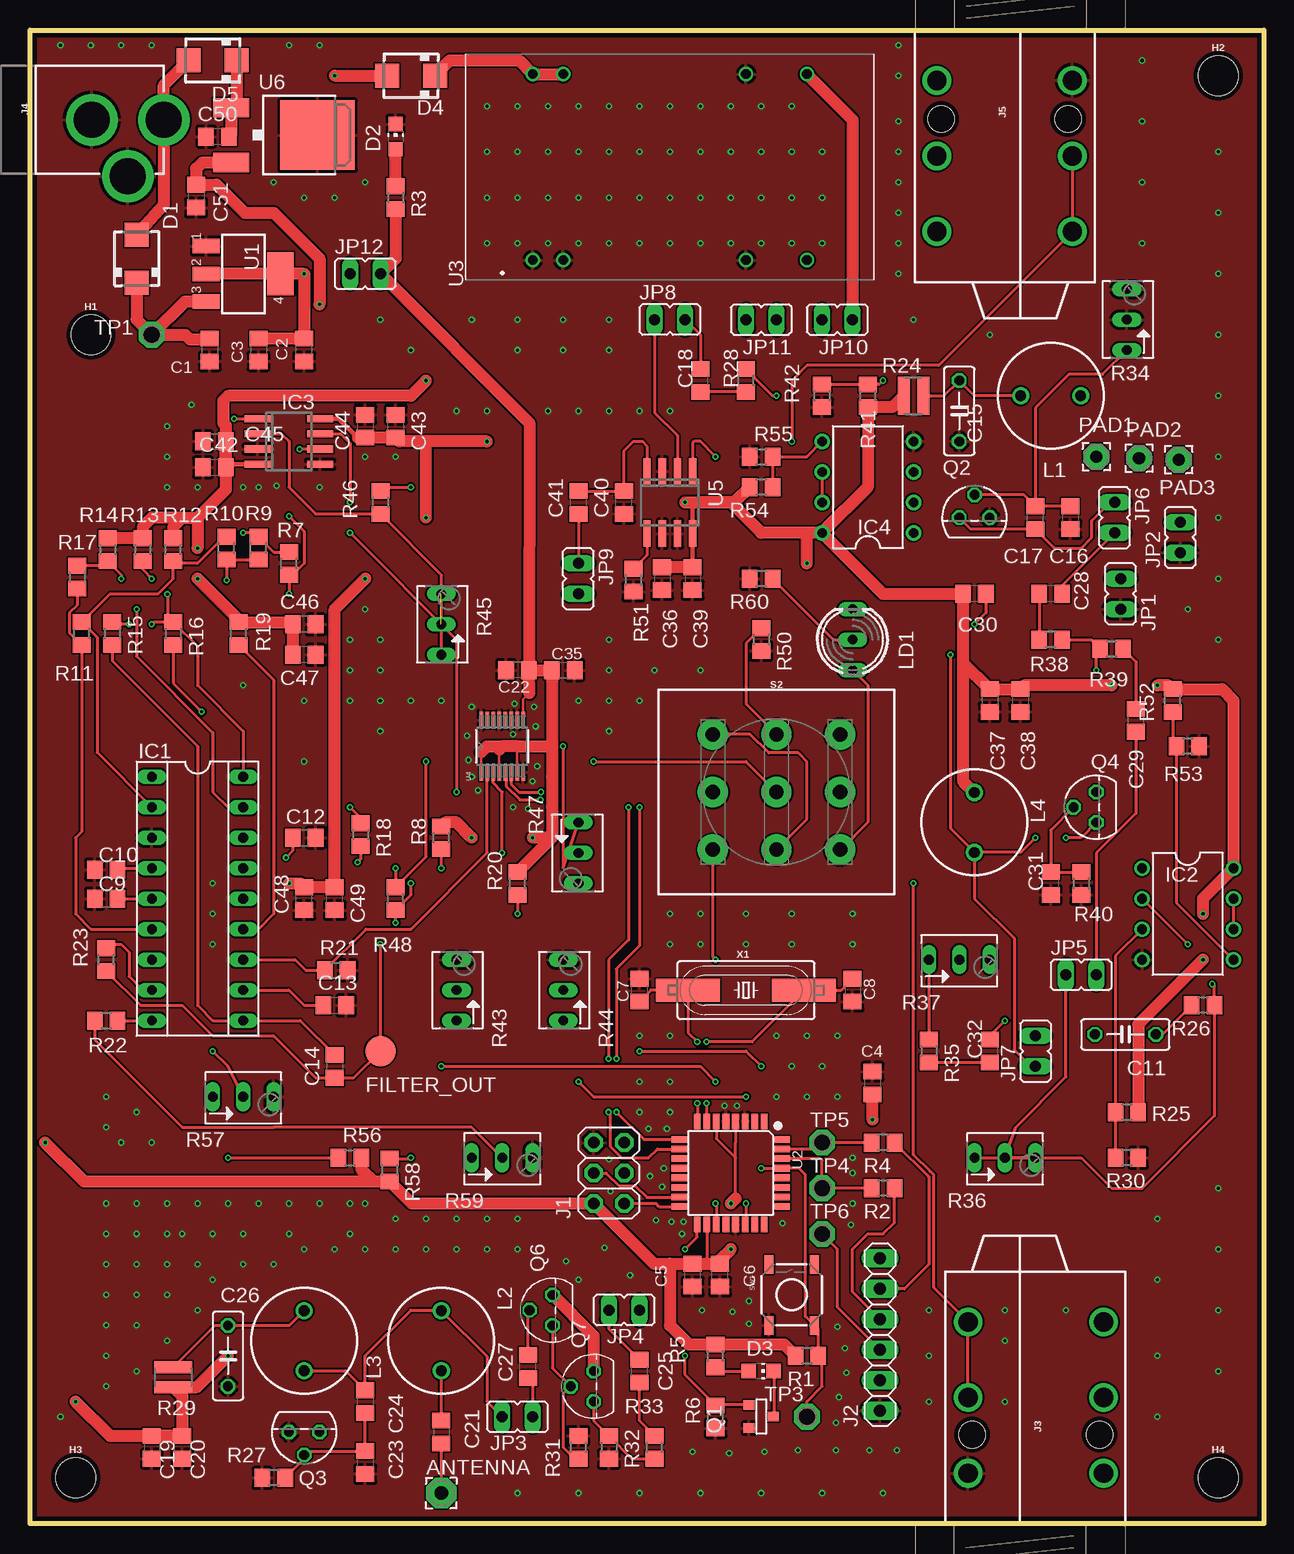
[diagram p3: board, top side]
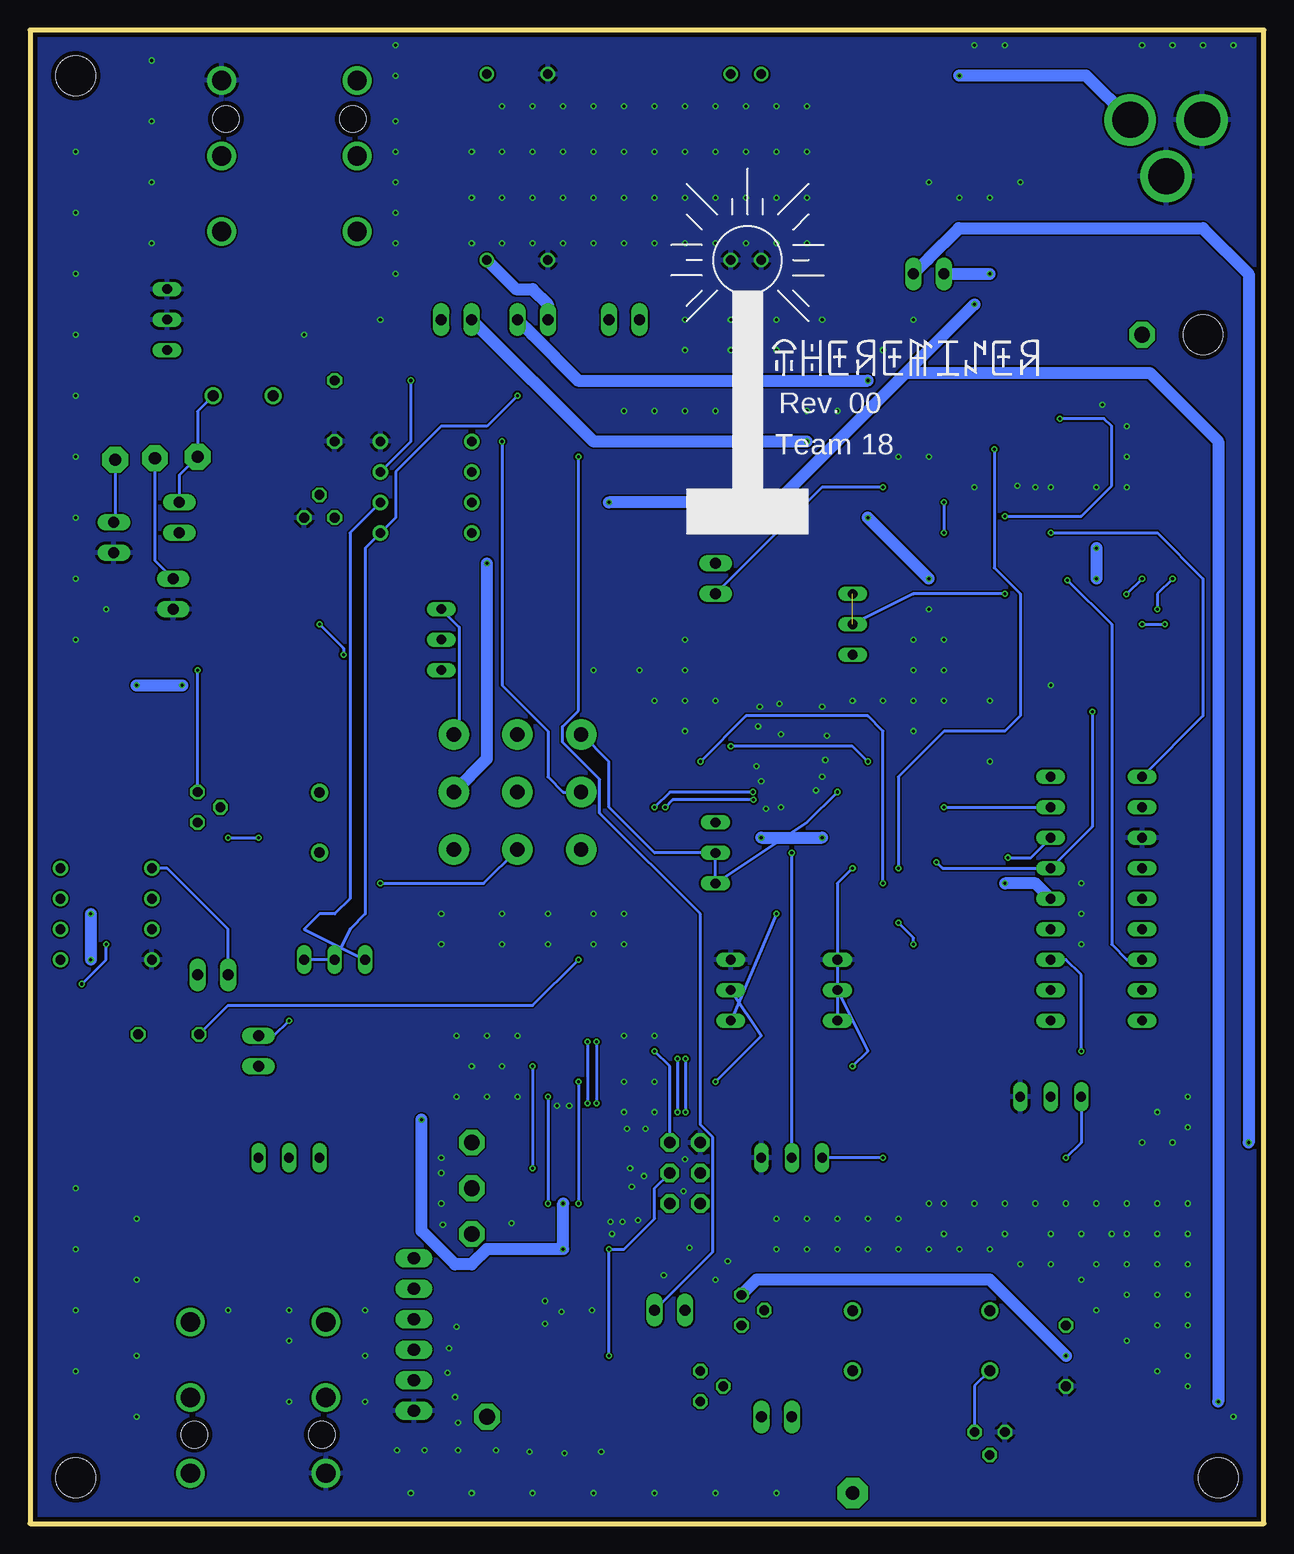
[diagram p4: board, bottom side, seen from below]

Size 102.87 x 124.46 mm. Coordinates in mm from the lower left corner, seen from the top.
Outline: 0,0 0,124.46 102.87,124.46 102.87,0 0,0
Copper layers (1*16): Top 0.035559375mm / dielectric 1.6mm / Bottom 0.035559375mm
Design rules "oshpark-2layer": minimum track width 6mil, minimum drill 10mil, track to track 6mil, track to pad 6mil, pad to pad 6mil, via to via 6mil, smd to smd 6mil, copper to edge 15mil, drill to drill 6mil, minimum pad ring 5mil, minimum via ring 5mil, stop-mask expansion 2.5mil, vias tented up to drill 0mil, thermal gap 10mil

### Footprints (pad centres in the part's own frame; a part is rotated, then mirrored left to right if it is on the bottom)
2,54/1,1 = drill 1.118 pad 2.54 octagon: 1 0,0
C0805 = smd 1.3 x 1.5: 1 -0.95,0; 2 0.95,0
C050-025X075 = drill 0.813 octagon: 1 -2.54,0; 2 2.54,0
SMA = smd 2 x 2: A 2,0; C -2,0
CHIP-LED0805 = smd 1.2 x 1.2: A 0,-1.05; C 0,1.05
B2,54 = smd 2.54 x 2.54: TP 0,0
STAND-OFF = hole 3.302: 0,0
SOCKET-18 = drill 0.813 long: 1 -10.16,-3.81; 2 -7.62,-3.81; 3 -5.08,-3.81; 4 -2.54,-3.81; 5 0,-3.81; 6 2.54,-3.81; 7 5.08,-3.81; 8 7.62,-3.81; 9 10.16,-3.81; 10 10.16,3.81; 11 7.62,3.81; 12 5.08,3.81; 13 2.54,3.81; 14 0,3.81; 15 -2.54,3.81; 16 -5.08,3.81; 17 -7.62,3.81; 18 -10.16,3.81
DIL08 = drill 0.813 pad 1.27: 1 -3.81,-3.81; 2 -1.27,-3.81; 3 1.27,-3.81; 4 3.81,-3.81; 5 3.81,3.81; 6 1.27,3.81; 7 -1.27,3.81; 8 -3.81,3.81
SO08 = smd 0.6 x 2.2: 1 -1.905,-2.6; 2 -0.635,-2.6; 3 0.635,-2.6; 4 1.905,-2.6; 5 1.905,2.6; 6 0.635,2.6; 7 -0.635,2.6; 8 -1.905,2.6
2X03 = drill 0.95 pad 1.55 octagon: 1 -2.54,-1.27; 2 -2.54,1.27; 3 0,-1.27; 4 0,1.27; 5 2.54,-1.27; 6 2.54,1.27
1X06 = drill 1.016 long: 1 -6.35,0; 2 -3.81,0; 3 -1.27,0; 4 1.27,0; 5 3.81,0; 6 6.35,0
AUDIO_JACK_0.25"_TRS_PTH_RA = drill 1.6: RING 10.5,-6.95; RING-NORM 10.5,4.35; SLEEVE 4.2,-6.95; SLEEVE-NORM 4.2,4.35; TIP 16.8,-6.95; TIP-NORM 16.8,4.35 | hole 2.2: 7.4,4; 7.4,-6.6
POWER_JACK_PTH = drill 2.997 pad 4.318: GND 0,7.7; GNDBREAK 4.7,10.7; PWR 0,13.7
JP1 = drill 0.914 long: 1 0,-1.27; 2 0,1.27
6000-XXXX-RC = drill 0.9 pad 1.422: 1 -2.5,0; 2 2.5,0
DUOLED-C-5MM = drill 0.813 long: AR 2.54,0; AX -2.54,0; C 0,0
2,15/1,0 = drill 1.016 pad 2.159 octagon: 1 0,0
SOT-23 = smd 0.787 x 0.889: 1 0.025,-1.016; 2 -0.94,1.016; 3 0.991,1.016
TO92R = drill 0.813 octagon: D -1.27,0; G 1.27,0; S 0,1.905
TO92 = drill 0.813 octagon: 1 1.27,0; 2 0,1.905; 3 -1.27,0
R0805 = smd 1.3 x 1.5: 1 -0.95,0; 2 0.95,0
PRL1632 = smd 1 x 3.2: 1 -0.822,0; 2 0.822,0
B64Y = drill 0.813 long: A 2.54,0; E -2.54,0; S 0,0
STOMP_SWITCH_3PDT = drill 1.2 pad 2.54: P$1 -5.3,4.8; P$2 -5.3,0; P$3 -5.3,-4.8; P$4 0,4.8; P$5 0,0; P$6 0,-4.8; P$7 5.3,4.8; P$8 5.3,0; P$9 5.3,-4.8
TACTILE_SWITCH_SMD = smd 1.524 x 0.762: 1 -2.54,1.905; 2 2.54,1.905; 3 -2.54,-1.905; 4 2.54,-1.905
P1-13 = drill 1.321 pad 2.159 octagon: TP 0,0
SOT223 = smd 1.219 x 2.235: 1 -2.311,-3.099; 2 0,-3.099; 3 2.311,-3.099 | smd 3.6 x 2.2: 4 0,3.099
TQFP32-0.8-7X7MM = smd 1.27 x 0.559: 1 -4.293,2.8; 2 -4.293,2; 3 -4.293,1.2; 4 -4.293,0.4; 5 -4.293,-0.4; 6 -4.293,-1.2; 7 -4.293,-2; 8 -4.293,-2.8; 17 4.293,-2.8; 18 4.293,-2; 19 4.293,-1.2; 20 4.293,-0.4; 21 4.293,0.4; 22 4.293,1.2; 23 4.293,2; 24 4.293,2.8 | smd 0.559 x 1.27: 9 -2.8,-4.293; 10 -2,-4.293; 11 -1.2,-4.293; 12 -0.4,-4.293; 13 0.4,-4.293; 14 1.2,-4.293; 15 2,-4.293; 16 2.8,-4.293; 25 2.8,4.293; 26 2,4.293; 27 1.2,4.293; 28 0.4,4.293; 29 -0.4,4.293; 30 -1.2,4.293; 31 -2,4.293; 32 -2.8,4.293
DIP1549W45P254L3404H940Q24 = drill 0.8 pad 1.15: 2 -7.747,11.43; 3 -7.747,8.89; 9 -7.747,-6.35; 11 -7.747,-11.43; 14 7.747,-11.43; 16 7.747,-6.35; 22 7.747,8.89; 23 7.747,11.43
MSOP-16_MS = smd 1.397 x 0.279: 1 -2.184,1.751; 2 -2.184,1.251; 3 -2.184,0.751; 4 -2.184,0.25; 5 -2.184,-0.25; 6 -2.184,-0.751; 7 -2.184,-1.251; 8 -2.184,-1.751; 9 2.184,-1.751; 10 2.184,-1.251; 11 2.184,-0.751; 12 2.184,-0.25; 13 2.184,0.25; 14 2.184,0.751; 15 2.184,1.251; 16 2.184,1.751
SO8 = smd 0.6 x 2.2: 1 -1.905,-2.6; 2 -0.635,-2.6; 3 0.635,-2.6; 4 1.905,-2.6; 5 1.905,2.6; 6 0.635,2.6; 7 -0.635,2.6; 8 -1.905,2.6
DPACK = smd 1.6 x 3: 1 -2.28,-4.8; 3 2.28,-4.8 | smd 5.8 x 6.2: 4 0,2.38
HC49UP = smd 5.334 x 1.93: 1 -4.826,0; 2 4.826,0

### Placement (x,y rotation side)
ANTENNA  34.29,2.54 0 top
C1  14.99,97.79 270 top
C2  22.86,97.79 90 top
C3  19.05,97.79 270 top
C4  70.23,36.7 270 top
C5  0.1u  [C0805]  55.24,20.7 90 top
C6  57.53,20.7 90 top
C7  50.8,44.45 90 top
C8  68.58,44.45 270 top
C9  6.35,52.07 0 top
C10  6.35,54.48 0 top
C11  91.31,40.77 0 top
C12  22.86,57.15 0 top
C13  25.4,43.18 0 top
C14  25.4,38.1 270 top
C15  77.47,92.71 270 top
C16  86.74,83.82 270 top
C17  83.82,83.82 90 top
C18  55.88,95.25 90 top
C19  10.16,6.35 270 top
C20  12.7,6.35 270 top
C21  34.29,7.62 270 top
C22  0.1u  [C0805]  40.64,71.12 180 top
C23  27.94,5.08 270 top
C24  27.94,10.16 270 top
C25  50.8,12.7 90 top
C26  16.51,13.97 270 top
C27  220p  [C0805]  41.53,13.08 90 top
C28  85.09,77.47 180 top
C29  92.2,66.93 90 top
C30  78.74,77.47 180 top
C31  85.09,53.34 90 top
C32  80.01,39.37 90 top
C35  44.45,71.12 0 top
C36  52.7,78.74 270 top
C37  80.01,68.58 270 top
C38  82.55,68.58 270 top
C39  55.24,78.74 270 top
C40  49.53,85.09 90 top
C41  45.72,85.09 90 top
C42  15.37,88.01 0 top
C43  30.48,91.44 270 top
C44  27.94,91.44 270 top
C45  15.37,90.17 0 top
C46  22.86,74.93 180 top
C47  22.86,72.39 180 top
C48  22.86,52.07 90 top
C49  25.4,52.07 90 top
C50  15.62,115.57 180 top
C51  13.84,110.62 270 top
D1  8.89,105.41 90 top
D2  30.48,115.57 0 top
D3  60.96,12.7 270 top
D4  M7  [SMA]  31.75,120.65 180 top
D5  15.24,121.92 180 top
FILTER_OUT  29.21,39.37 0 top
H1  5.08,99.06 0 top
H2  99.06,120.65 0 top
H3  3.81,3.81 0 top
H4  99.06,3.81 0 top
IC1  13.97,52.07 270 top
IC2  96.52,50.8 270 top
IC3  21.59,90.17 270 top
IC4  69.85,86.36 90 top
J1  48.26,29.21 90 top
J2  70.87,15.75 90 top
J3  82.55,0 90 top
J4  -2.54,116.97 270 top
J5  82.55,124.46 270 top
JP1  90.93,77.47 180 top
JP2  95.89,82.17 0 top
JP3  40.64,8.89 270 top
JP4  49.53,17.78 270 top
JP5  87.63,45.72 270 top
JP6  90.42,83.82 180 top
JP7  83.82,39.37 0 top
JP8  53.34,100.33 270 top
JP9  45.72,78.74 180 top
JP10  67.31,100.33 90 top
JP11  60.96,100.33 90 top
JP12  27.94,104.14 270 top
L1  85.09,93.98 0 top
L2  34.29,15.24 270 top
L3  22.86,15.24 270 top
L4  78.74,58.42 270 top
LD1  68.58,73.66 90 top
PAD1  88.9,88.9 0 top
PAD2  92.46,88.77 0 top
PAD3  95.76,88.65 0 top
Q1  60.96,8.89 90 top
Q2  78.74,83.82 0 top
Q3  22.86,7.62 180 top
Q4  88.9,59.69 90 top
Q6  43.56,17.78 90 top
Q7  46.99,11.43 90 top
R1  64.77,13.97 180 top
R2  71.12,27.94 180 top
R3  30.48,110.49 270 top
R4  71.12,31.75 180 top
R5  57.15,13.97 90 top
R6  57.15,8.89 90 top
R7  21.59,80.01 90 top
R8  34.29,57.15 90 top
R9  19.05,81.28 90 top
R10  16.38,81.28 90 top
R11  4.32,74.17 90 top
R12  11.94,81.15 90 top
R13  9.4,81.15 270 top
R14  6.48,81.15 270 top
R15  6.86,74.17 270 top
R16  11.94,74.17 270 top
R17  3.94,78.87 270 top
R18  27.56,57.4 270 top
R19  17.4,74.17 90 top
R20  40.64,53.34 90 top
R21  25.53,46.1 0 top
R22  6.35,41.91 0 top
R23  6.35,46.99 90 top
R24  73.66,93.98 180 top
R25  91.44,34.29 0 top
R26  97.79,43.18 180 top
R27  20.32,3.81 180 top
R28  59.69,95.25 90 top
R29  11.94,12.19 90 top
R30  91.44,30.48 180 top
R31  45.72,6.35 90 top
R32  48.26,6.35 270 top
R33  52.07,6.35 90 top
R34  91.44,100.33 90 top
R35  74.93,39.37 270 top
R36  500k  [B64Y]  81.28,30.48 0 top
R37  77.47,46.99 0 top
R38  85.09,73.66 180 top
R39  90.17,72.9 0 top
R40  87.63,53.34 270 top
R41  69.85,93.98 90 top
R42  66.04,93.98 90 top
R43  35.56,44.45 90 top
R44  44.45,44.45 90 top
R45  34.29,74.93 90 top
R46  29.21,85.09 270 top
R47  45.72,55.88 270 top
R48  30.48,52.07 90 top
R50  60.96,73.66 270 top
R51  50.29,78.61 270 top
R52  95.25,68.58 90 top
R53  96.52,64.77 180 top
R54  60.96,86.36 180 top
R55  60.96,88.9 0 top
R56  26.67,30.48 0 top
R57  17.78,35.56 0 top
R58  29.97,29.46 270 top
R59  39.37,30.48 0 top
R60  60.96,78.74 180 top
S2  62.23,60.96 0 top
SW1  63.5,19.05 90 top
TP1  10.16,99.06 0 top
TP3  64.77,8.89 0 top
TP4  66.04,27.94 0 top
TP5  66.04,31.75 0 top
TP6  66.04,24.13 0 top
U1  17.78,104.14 270 top
U2  58.42,29.21 270 top
U3  53.34,113.03 90 top
U4  39.37,64.77 90 top
U5  53.34,85.09 180 top
U6  21.59,115.7 270 top
X1  59.69,44.45 0 top

### Tracks (layer width: path | path; a pad name or v marks a point on that pad's centre or on a via)
5VEXT  (via drill 0.25)
  Top 1: C3.1 C2.2 v22.86,104.14 U1.4 U1.2
  Bottom 1: JP12.1 v22.86,104.14
!RESET  (via drill 0.25)
  Top 0.254: v50.8,39.37 59.69,39.37 v60.96,38.1 | v60.96,29.59 62.69,29.59 U2.29 64.12,29.61 64.64,29.08 64.64,17.27 SW1.3 65.72,16.2 R1.1 66.04,13.65 66.04,11.43 64.77,10.16 TP3.TP
  Bottom 0.254: J1.5 49.53,38.1 v50.8,39.37 | v60.96,38.1 v60.96,29.59
+5V  (via drill 0.25)
  Top 0.203: U4.1 37.62,63.5 37.62,64.29 | U4.7 40.62,64.75 | U4.4 39.12,64.52 | U4.9 41.12,68.68 41.64,69.2
  Top 0.254: U2.18 56.42,21.68 | U2.4 58.82,31.75 58.82,30.48 | 58.82,27.07 58.82,30.48 | U2.6 57.22,32.08 58.82,30.48
  Top 1: R3.2 30.48,105.41 JP12.2 41.64,91.71 C22.1 | C22.1 C35.1 43.5,64.77 | 43.5,64.77 43.5,62.23 43.5,59.69 43.5,57.15 | 43.5,57.15 R20.2 | 43.5,57.15 v41.91,57.15 | v36.83,57.15 35.56,58.42 34.61,58.42 R8.2 | 39.37,64.77 38.1,64.77 37.62,64.29 | 40.64,64.77 39.37,64.77 | 40.64,64.77 43.5,64.77 | 41.64,69.2 C22.1 | 40.62,64.75 40.64,64.77 | 39.12,64.52 39.37,64.77 | R56.2 27.62,29.53 28.64,28.51 29.21,28.51 | 29.21,28.51 R58.2 31.82,26.67 J1.2 52.01,21.65 53.34,21.65 | 56.39,21.65 C5.2 53.34,21.65 | 56.39,21.65 C6.2 57.53,21.97 v58.42,22.86 | 56.42,21.68 56.39,21.65 | v1.27,31.75 4.51,28.51 29.21,28.51 | 53.34,21.65 53.34,16.51 54.93,14.92 R5.2 62.87,14.92 R1.2 | 58.82,27.07 v58.42,26.67 | v70.23,33.66 C4.2
  Bottom 1: v41.91,57.15 v36.83,57.15 | JP12.2 28.01,105.34 28.01,105.38 25.44,107.95 5.08,107.95 1.27,104.14 v1.27,31.75 | v58.42,26.67 v58.42,22.86 64.77,22.86 66.04,21.59 67.44,21.59 70.23,24.38 v70.23,33.66
+9V  (via drill 0.25)
  Top 0.381: C39.1 U5.8 55.24,83.82 55.24,85.09
  Top 1: U6.3 14.36,113.42 13.84,112.9 C51.1 15.56,111.57 17.91,109.22 20.32,109.22 24.13,105.41 v24.13,101.6 | C39.1 C36.1 | v3.81,10.16 6.67,7.3 C19.1 C20.1 12.7,10.61 R29.1 13.91,11.37 v16.51,13.97 | Q6.1 46.99,15.62 Q7.1 | R24.2 71.89,93.03 R41.1 69.85,86.36 IC4.8 | v54.61,85.09 55.24,85.09 55.88,85.09 | 55.88,85.09 58.42,85.09 60.96,82.55 64.77,82.55 | IC4.8 64.77,82.55 | IC4.8 71.12,77.47 C30.2 77.79,71.75 | 77.79,71.75 C37.1 C38.1 82.87,69.85 v90.17,69.85 | 77.79,71.75 77.79,61.87 L4.1 | v93.98,69.85 94.93,69.85 R52.2 99.38,69.53 100.33,68.58 IC2.8 97.79,52.07 v97.79,50.8 | v97.79,46.99 92.39,41.59 R25.2 | v64.77,80.01 64.77,82.55 | R54.2 58.74,85.09 55.88,85.09
  Bottom 1: v24.13,101.6 29.84,95.89 | 29.84,95.89 40.64,85.09 v54.61,85.09 | 29.84,95.89 9.53,95.89 3.81,90.17 v3.81,10.16 | v16.51,13.97 22.86,20.32 42.29,20.32 Q6.1 | v97.79,50.8 v97.79,46.99 | S2.P$8 64.77,63.72 v64.77,80.01 | v93.98,69.85 v90.17,69.85
+15V  (via drill 0.25)
  Top 0.381: IC3.8 25.4,92.08 25.74,92.08 27.32,90.49
  Top 1: v38.1,90.17 33.02,90.17 | 33.02,90.17 30.8,90.17 C43.2 C44.2 27.32,90.49 | v27.94,78.74 25.4,76.2 C49.2 C48.2 22.54,53.34 v21.59,53.34 | v33.02,83.82 33.02,90.17
  Bottom 1: JP10.2 55.88,90.17 v38.1,90.17 | v27.94,78.74 v33.02,83.82 | IC1.14 19.05,53.34 v21.59,53.34
-15V  (via drill 0.25)
  Top 0.381: IC3.4 16.57,88.27
  Top 1: C42.2 16.32,88.9 | 16.32,88.9 C45.2 | C42.2 16.32,86.17 13.97,83.82 | 12.7,83.82 13.97,83.82 | 12.7,83.82 11.94,83.06 R12.2 | 12.7,83.82 10.16,83.82 9.4,83.06 R13.1 R14.1 | 13.97,83.82 v13.97,81.28 | v13.97,78.74 17.4,75.31 R19.2 21.72,75.12 C46.2 C47.2 | v33.02,95.25 31.75,93.98 16.51,93.98 16.11,93.58 16.11,91.7 16.32,91.49 16.32,88.9 | 16.57,88.27 C42.2
  Bottom 1: v13.97,81.28 v13.97,78.74 | JP11.1 61.03,99.13 61.03,99.09 57.19,95.25 v33.02,95.25
ADC6  (via drill 0.25)
  Top 0.254: v34.29,38.1 55.88,38.1 v57.15,36.83 | v57.15,26.67 57.22,26.6 U2.19
  Bottom 0.254: R43.S 33.02,39.37 v34.29,38.1 | v57.15,36.83 v57.15,26.67
ADC7  (via drill 0.25)
  Top 0.254: v45.72,36.83 46.99,35.56 v59.69,35.56 | v59.69,26.67 59.69,24.99 U2.22
  Bottom 0.254: R44.S 41.91,40.64 v45.72,36.83 | v59.69,35.56 v59.69,26.67
ANTENNA
  Top 0.254: C21.2 ANTENNA.1
AUDIO_IN  (via drill 0.25)
  Top 0.254: v57.15,46.99 56.93,47.21 S2.P$3
  Bottom 0.254: C11.1 86.36,43.18 60.96,43.18 v57.15,46.99
AVR-RXD
  Top 0.254: U2.30 65.46,30.41 65.48,30.39 65.91,30.39 66.04,30.26 TP4.TP R2.2
AVR-TXD
  Top 0.254: U2.31 65.5,31.21 TP5.TP R4.2
FILTER_OUTPUT  (via drill 0.25)
  Top 0.254: R23.1 9.21,43.18 12.7,43.18 15.24,40.64 20.32,40.64 23.81,37.15 C14.2 26.99,37.15 FILTER_OUT.TP v29.21,48.26 | v30.48,50.06 R48.1 31.75,52.39 v31.75,53.34 | v46.99,63.5 59.69,63.5 S2.P$5
  Bottom 0.254: v29.21,48.26 29.21,48.79 v30.48,50.06 | v31.75,53.34 31.75,66.04 33.02,67.31 43.18,67.31 v46.99,63.5
FREQ_CV  (via drill 0.25)
  Top 0.254: R57.S 16.51,38.1 v15.24,39.37 | IC1.12 22.1,46.99 22.99,46.1 R21.1 28.01,49.53 31.75,49.53 38.12,55.9 U4.2
  Bottom 0.254: v15.24,39.37 15.24,45.72 16.51,46.99 IC1.12
FTDI-RXD
  Top 0.254: R4.1 74.93,28.89 74.93,21.59 72.9,19.56 J2.5
FTDI-TXD
  Top 0.254: J2.4 68.58,19.3 68.58,22.86 69.85,24.13 71.12,24.13 72.07,25.08 R2.1
GND  (via drill 0.25)
  other vias: 2.54,123.19 5.08,123.19 7.62,123.19 10.16,123.19 21.59,123.19 24.13,123.19 72.39,123.19 72.39,120.65 72.39,116.84 72.39,114.3 72.39,111.76 72.39,109.22 72.39,106.68 72.39,104.14 38.1,118.11 40.64,118.11 43.18,118.11 45.72,118.11 48.26,118.11 50.8,118.11 53.34,118.11 55.88,118.11 58.42,118.11 60.96,118.11 63.5,118.11 63.5,114.3 60.96,114.3 58.42,114.3 55.88,114.3 53.34,114.3 50.8,114.3 48.26,114.3 45.72,114.3 43.18,114.3 40.64,114.3 38.1,114.3 38.1,110.49 40.64,110.49 43.18,110.49 45.72,110.49 48.26,110.49 50.8,110.49 53.34,110.49 55.88,110.49 58.42,110.49 60.96,110.49 63.5,110.49 66.04,110.49 66.04,114.3 38.1,106.68 40.64,106.68 43.18,106.68 45.72,106.68 48.26,106.68 50.8,106.68 53.34,106.68 55.88,106.68 58.42,106.68 60.96,106.68 63.5,106.68 66.04,106.68 37.34,61.09 40.26,59.69 41.53,59.56 41.91,61.85 42.29,63.12 36.83,62.23 36.58,63.63 36.45,65.66 36.83,68.07 42.04,68.07 42.16,66.42 2.54,8.89 6.35,11.43 8.89,12.7 11.43,15.24 13.97,17.78 15.24,20.32 17.78,21.59 20.32,21.59 22.86,22.86 25.4,22.86 27.94,22.86 30.48,22.86 33.02,22.86 35.56,22.86 38.1,22.86 40.64,22.86 44.7,21.84 6.35,13.97 6.35,16.51 6.35,19.05 6.35,21.59 6.35,24.13 8.89,24.13 12.7,24.13 15.24,24.13 17.78,24.13 8.89,21.59 8.89,19.05 8.89,16.51 11.43,21.59 11.43,24.13 11.43,19.05 13.97,21.59 6.35,26.67 8.89,26.67 11.43,26.67 13.97,26.67 16.51,26.67 19.05,26.67 21.59,26.67 24.13,26.67 27.94,26.67 21.59,24.13 6.35,35.56 7.62,31.75 8.89,34.29 6.35,33.02 10.16,31.75 40.64,25.4 38.1,25.4 35.56,25.4 33.02,25.4 30.48,25.4 26.67,26.67 26.67,24.13 34.29,68.58 31.75,68.58 29.21,68.58 29.21,71.12 29.21,73.66 27.94,76.2 26.67,73.66 26.67,71.12 26.67,68.58 29.21,66.04 22.86,63.5 22.86,68.58 17.78,69.85 45.72,68.58 48.26,68.58 50.8,68.58 48.26,66.04 48.26,71.12 48.26,73.66 52.07,71.12 55.88,71.12 53.34,50.8 53.34,48.26 55.88,50.8 55.88,48.26 59.69,50.8 59.69,48.26 53.34,40.64 50.8,40.64 53.34,36.83 50.8,36.83 50.8,34.29 53.34,34.29 62.23,40.64 64.77,40.64 67.31,40.64 63.5,38.1 66.04,38.1 64.77,35.56 62.23,35.56 67.31,35.56 57.91,34.8 58.93,34.8 68.58,30.48 68.58,29.21 68.58,26.67 68.45,24.89 62.74,25.02 54.48,25.15 54.36,24.13 53.47,25.15 52.2,25.27 52.7,28.07 52.83,29.59 51.69,28.96 53.09,32.89 51.56,32.89 48.26,30.35 48.39,27.69 45.72,20.32 47.88,22.99 50.04,20.7 56.01,17.78 58.55,17.65 59.94,18.54 59.94,16.64 67.31,16.38 67.94,14.61 68.07,12.57 67.44,10.54 67.18,8.38 55.24,5.97 58.29,5.84 61.21,5.97 64.01,6.1 67.18,6.1 69.98,6.1 72.26,6.1 40.64,2.54 45.72,2.54 50.8,2.54 55.88,2.54 60.96,2.54 66.04,2.54 71.12,2.54 74.93,10.16 74.93,13.97 74.93,17.78 48.26,100.33 44.45,100.33 40.64,100.33 36.83,100.33 40.64,97.79 44.45,97.79 48.26,97.79 73.66,100.33 80.01,99.06 19.05,86.36 17.78,86.36 13.97,86.36 11.43,86.36 11.43,88.9 11.43,91.44 13.46,93.22 20.57,86.49 24.13,86.36 27.94,88.9 30.48,88.9 20.32,111.76 22.86,110.49 25.4,110.49 27.94,111.76 92.71,121.92 92.71,116.84 92.71,111.76 92.71,106.68 99.06,114.3 99.06,109.22 99.06,104.14 99.06,99.06 99.06,93.98 99.06,88.9 99.06,83.82 99.06,78.74 96.52,76.2 99.06,73.66 99.06,27.94 93.98,25.4 99.06,22.86 93.98,20.32 99.06,17.78 93.98,13.97 99.06,12.7 93.98,8.89 86.36,17.78 81.28,17.78 81.28,15.24 81.28,10.16 63.5,50.8 63.5,48.26 68.58,50.8 68.58,48.26 53.34,92.71 50.8,92.71 48.26,92.71 45.72,92.71 43.18,92.71 38.1,92.71 35.56,92.71 31.75,97.79 29.21,100.33 15.24,53.34 15.24,50.8 15.24,48.26 40.39,68.33 40.26,65.79
  pour Top: 0,0 0,124.46 102.87,124.46 102.87,0
  pour Bottom: 0,0 0,124.46 102.87,124.46 102.87,0
MISO
  Top 0.254: J1.1 52.2,26.67 52.46,26.41 U2.16
MOSI
  Top 0.254: J1.4 48.04,29.21 49.09,28.16 50.46,28.16 51.44,27.18 54.09,27.18 U2.15
N$1
  Top 0.254: L2.2 C21.1
N$2
  Top 0.254: R5.1 57.47,12.7 D3.A
N$3
  Top 1: R3.1 D2.A
N$4
  Top 0.254: D3.C 62.01,8.95 Q1.1
N$5
  Top 0.254: J2.3 67.31,18.03 67.31,22.86 TP6.TP
N$6  (via drill 0.25)
  Top 0.254: R7.2 20.32,80.96 R9.2 18.73,82.55 v17.78,82.55
  Bottom 0.254: v17.78,82.55 8.89,82.55 5.08,78.74 5.08,67.31 IC1.1
N$7  (via drill 0.25)
  Top 0.254: R9.1 R10.1 v16.38,78.61
  Bottom 0.254: v16.38,78.61 12.7,74.93 12.7,48.26 11.43,46.99 IC1.7
N$8
  Top 0.254: C9.2 IC1.5
N$9
  Top 0.254: C10.2 7.43,54.61 IC1.4
N$10
  Top 0.254: IC1.2 5.59,64.26 5.59,73.85 R11.2 6.67,77.47 10.67,77.47 11.94,78.74 11.94,80.01 | 11.94,80.01 R12.1 | R10.2 16.19,82.23 13.97,80.01 11.94,80.01
N$11
  Top 0.254: R17.2 3.94,76.53 3.29,75.88 3.29,74.25 R11.1 4.32,57.66 3.81,57.15 3.81,50.8 5.08,49.53 IC1.6
N$12
  Top 0.254: R15.2 6.86,71.88 13.97,64.77 13.97,43.18 15.24,41.91 IC1.10 22.54,41.91 C14.1
N$13  (via drill 0.25)
  Top 0.254: R13.2 9.4,79.5 v10.16,78.74 | v11.46,77.44 11.46,75.6 | v10.16,74.93 10.35,75.12 R16.1 13.97,73.09 13.97,69.85 17.78,66.04 IC1.18 | v8.26,74.93 7.05,74.93 R15.1
  Top 0.406: 11.46,75.6 R16.1
  Bottom 0.254: v10.16,78.74 v11.46,77.44 | v10.16,74.93 v8.26,74.93
N$14  (via drill 0.25)
  Top 0.254: R17.1 6.09,79.82 R14.2 7.62,79.06 v7.62,78.74 | v8.89,76.2 8.89,72.26 15.24,65.91 15.24,60.96 16.51,59.69 IC1.17 | R18.1 27.56,58.8 v26.67,59.69
  Bottom 0.254: v7.62,78.74 8.89,77.47 v8.89,76.2 | v26.67,59.69 IC1.17
N$15  (via drill 0.25)
  Top 0.254: R16.2 11.94,70.04 v14.32,67.66 | R18.2 27.56,55.37 v27.3,55.12
  Bottom 0.254: v14.32,67.66 14.32,58.07 IC1.15 26.8,54.61 v27.3,55.12
N$16  (via drill 0.25)
  Top 0.254: C12.1 21.91,56.07 v21.34,55.5
  Bottom 0.254: v21.34,55.5 19.43,55.5 IC1.16
N$17
  Top 0.254: R19.1 20.32,70.3 20.32,50.8 19.05,49.53 IC1.13
N$18
  Top 0.254: IC1.11 21.59,44.45 22.86,43.18 C13.1
N$19
  Top 0.254: IC3.2 20.95,90.81 21.59,90.17 21.59,86.36 23.81,84.14 R46.2 34.29,79.06 R45.E
N$20
  Top 0.254: R23.2 6.67,48.26 7.62,48.26 8.26,47.62 8.26,45.59 9.4,44.45 IC1.8
N$21
  Top 0.254: R22.2 IC1.9
N$22
  Top 0.254: L1.1 78.74,93.98 C15.1 76.2,93.98 R24.1
N$23
  Top 0.254: R28.1 C18.1
N$24  (via drill 0.25)
  Top 0.254: v57.15,88.9 55.88,90.17 55.37,90.17 55.24,90.04 U5.1
  Bottom 0.254: JP4.2 45.94,22.64 45.94,32.19 46.99,33.24 46.99,50.8 55.38,59.19 55.38,62.02 58.48,65.12 58.48,66.4 57.15,67.73 v57.15,88.9
N$25
  Top 0.254: R33.2 50.8,8.57 C25.1
N$26
  Top 0.254: L3.2 26.31,12.74 C24.1 27.94,13.97 31.75,17.78 34.25,17.78 L2.1 38.1,13.93 38.1,10.16 JP3.1
  Bottom 0.254: L3.2 24.13,11.47 Q3.D
N$27
  Top 0.254: C27.2 41.53,17.65 Q6.2
N$28
  Top 0.254: IC2.3 90.49,47.31 R25.1 R30.2
N$29  (via drill 0.25)
  Top 0.254: R42.2 R41.2 70.8,94.93 v71.12,95.25
  Bottom 0.254: IC4.3 71.12,90.17 v71.12,95.25
N$30
  Top 0.254: Q6.3 43.56,12.95 Q7.2 44.45,10.79 44.45,6.35 45.4,5.4 R31.1
N$31
  Top 0.254: Q7.3 46.99,8.57 R32.1 50.16,5.4 R33.1
N$32  (via drill 0.25)
  Top 0.254: v16.51,30.48 R56.1
  Bottom 0.254: R57.E 15.24,31.75 v16.51,30.48
N$33
  Top 0.254: R35.2 C32.1
N$34
  Top 0.254: C16.1 C17.2 | C17.2 82.86,85.72 Q2.S | R34.E 89.41,95.76 86.61,95.76 83.82,92.96 C17.2
N$35
  Top 0.254: JP6.1 90.04,85.09 88.52,83.57 88.52,82.17 87.63,81.28 85.41,81.28 C17.1 78.42,82.87 Q2.D
  Bottom 0.254: L1.2 88.9,92.67 PAD1.1 90.42,87.38 JP6.1
N$36
  Top 0.254: JP8.1 52.07,92.58 53.98,90.68 U5.2
N$37  (via drill 0.25)
  Top 0.254: J5.RING-NORM J5.TIP-NORM 75.76,96.52 64.77,96.52 63.5,95.25 v63.5,90.17
  Bottom 0.254: v63.5,90.17 63.5,69.85 59.69,66.04 59.69,62.23 58.42,60.96 S2.P$2
N$38
  Top 0.254: R50.1 59.69,73.34 59.69,68.3 S2.P$4
N$39
  Top 0.254: C11.2 94.43,40.77 R26.2
N$40  (via drill 0.25)
  Top 0.254: v98.55,44.96 98.74,44.77 R26.1 98.74,33.97 92.71,27.94 90.17,27.94 87.63,30.48 R36.E | v96.52,48.26 IC2.2
  Bottom 0.254: v98.55,44.96 96.52,46.99 v96.52,48.26
N$41
  Top 0.254: JP5.1 86.36,37.21 82.17,33.02 R36.S R36.A
  Bottom 0.254: JP5.1 86.36,49.53 91.44,54.61 IC2.1
N$42
  Top 0.254: R39.2 92.2,71.82 C29.2
N$43
  Top 0.254: C28.2 R38.2
N$44  (via drill 0.25)
  Top 0.254: R38.1 88.46,73.66 R39.1 88.9,72.58 v88.9,71.12
  Bottom 0.254: Q4.G v88.9,71.12
N$45  (via drill 0.25)
  Top 0.254: C30.1 79.69,75.88 v78.74,74.93 | v76.73,72.39 76.73,57.93 L4.2 | Q4.D 87.63,57.15 v86.36,57.15 | v83.82,57.15 82.59,55.92 L4.2 | L4.2 78.74,52.07 82.04,48.77 82.04,39.5 83.44,38.1 JP7.1
  Bottom 0.254: v78.74,74.93 76.73,72.92 v76.73,72.39 | v86.36,57.15 v83.82,57.15
N$46
  Top 0.254: Q4.S 85.09,57.78 C31.2 R40.1
N$47
  Top 1: D5.C 17.24,118.43 U6.1 16.79,115.79 C50.1
N$48
  Top 0.254: R37.E 74.93,41.91 R35.1
  Bottom 0.254: IC4.2 76.2,82.55 76.2,52.07 77.47,50.8 78.74,50.8 80.01,49.53 R37.E
N$49  (via drill 0.25)
  Top 0.254: R28.2 61.91,93.98 v62.23,93.98
  Bottom 0.254: v62.23,93.98 64.77,91.44 68.58,91.44 72.39,87.63 72.39,83.82 IC4.1 74.93,81.28 74.93,50.8 76.2,49.53 R37.S R37.A
N$50  (via drill 0.25)  (1 unrouted)
  Top 0.254: v21.59,83.95 22.86,82.68 22.86,80.01 21.91,79.06 R7.1 v21.59,77.47 | v17.02,92.08 IC3.1
  Bottom 0.254: v21.59,83.95 15.24,83.95 12.7,86.49 12.7,91.44 13.34,92.08 v17.02,92.08 | v21.59,77.47 29.21,77.47 R45.S
N$51  (via drill 0.25)
  Top 1: D1.A 11.16,109.88 J4.PWR 11.16,119.84 D5.A | v25.4,120.65 D4.A
  Bottom 1: J4.PWR 14.84,120.65 v25.4,120.65
N$52  (via drill 0.25)
  Top 0.254: IC3.6 v22.48,89.53 | v30.48,54.61 R48.2 33.02,55.56 v33.02,63.5 | v44.45,64.77 44.45,54.61 R47.E
  Bottom 0.254: v22.48,89.53 22.48,79.63 20.32,77.47 20.32,67.31 21.59,66.04 26.67,66.04 30.48,62.23 v30.48,54.61 | v33.02,63.5 34.29,64.77 v44.45,64.77
N$53
  Bottom 0.254: S2.P$7 67.08,66.21 67.08,74.7 LD1.AR
N$54
  Top 1: U3.22 U3.23 40.77,121.92 35.02,121.92 D4.C
N$55
  Top 1: U3.14 68.58,116.97 JP10.1
N$56
  Bottom 1: U3.11 62.36,102.87 60.96,102.87 59.69,101.6 JP11.2
N$57
  Top 0.254: R29.2 15.43,16.51 C26.1 21.63,16.51 L3.1
N$58
  Top 0.254: LD1.AX 69.85,69.85 69.85,58.42 67.59,56.16 S2.P$9
N$59
  Top 0.254: U5.5 51.44,80.71 R51.1
N$60
  Top 0.254: IC2.7 IC2.6
N$61
  Top 0.254: R52.1 95.25,65.09 R53.2 95.57,51.75 IC2.5
N$62
  Top 0.254: IC4.5 64.77,88.9 R55.2 R54.1
N$63
  Top 0.254: IC4.6 IC4.7
N$64
  Top 0.254: R27.1 22.86,5.4 Q3.S 23.18,6.03 C23.1 C24.2
N$65  (via drill 0.25)
  Top 0.254: R58.1 31.68,30.41 v31.75,30.48
  Bottom 0.254: v31.75,30.48 R59.E
N$66
  Bottom 0.254: PAD2.1 92.46,80.26 JP1.1
N$67
  Bottom 0.254: PAD3.1 95.76,83.57 JP2.2
N$69
  Top 0.254: C27.1 41.91,11.75 JP3.2
N$70
  Top 0.254: C25.2 48.26,16.19 JP4.1
N$71
  Top 0.254: C29.1 92.2,59.18 88.9,55.88 JP5.2
N$72
  Top 0.254: JP6.2 86.04,78.17 C28.1
N$73  (via drill 0.25)
  Top 0.254: v81.28,41.91 80.01,40.64 C32.2
  Bottom 0.254: JP7.2 82.55,40.64 v81.28,41.91
N$74
  Top 0.254: JP8.2 55.88,99.06 C18.2
N$75
  Top 0.254: U5.4 51.44,89.79 51.05,90.17 50.29,90.17 49.53,89.41 C40.2 C41.2
N$76
  Top 0.254: R60.1 66.99,73.66 LD1.C
N$77  (via drill 0.25)
  Top 0.254: R8.1 v34.29,54.61
  Bottom 0.254: v34.29,54.61 35.56,53.34 R43.E
N$78  (via drill 0.25)
  Top 0.254: R20.1 v40.64,50.8
  Bottom 0.254: v40.64,50.8 R44.E
N$79
  Top 0.254: C41.1 JP9.1
OUTPUT  (via drill 0.25)
  Top 0.254: IC3.7 25.91,90.81 26.67,90.04 v26.67,85.09 | v26.67,82.55 35.56,73.66 v35.56,60.96 | S2.P$6 64.77,58.7 64.77,63.5 64.06,64.21 61.59,64.21 60.04,65.76 S2.P$1 | 75.34,29.06 75.06,29.34 | 75.06,29.34 73.66,30.73 v73.66,53.34 | 75.06,29.34 75.34,29.06 | 75.34,29.06 75.34,19.66 J3.TIP-NORM J3.RING-NORM
  Bottom 0.254: v26.67,85.09 v26.67,82.55 | v35.56,60.96 38.1,58.42 R47.A R47.S 50.8,55.88 54.61,59.69 54.61,63.5 56.87,65.76 S2.P$1 | v73.66,53.34 65.05,53.34 S2.P$6
PWM_A  (via drill 0.25)
  Top 0.254: U4.6 40.12,61.61 40.77,60.96 v42.59,60.96 | v50.8,59.69 50.8,48.13 48.9,46.23 v48.9,38.73 | v48.9,34.29 51.17,32.01 U2.9
  Bottom 0.254: v42.59,60.96 49.53,60.96 v50.8,59.69 | v48.9,38.73 v48.9,34.29
PWM_B  (via drill 0.25)
  Top 0.254: U4.5 39.7,62.5 39.7,61.45 40.85,60.3 v42.55,60.3 | v49.91,59.69 49.91,48.64 48.23,46.97 v48.23,38.73 | v48.23,34.29 48.36,34.16 48.36,31.43 49.28,30.51 49.28,30.48 51.56,30.48 52.29,31.21 U2.10
  Bottom 0.254: v42.55,60.3 49.3,60.3 v49.91,59.69 | v48.23,38.73 v48.23,34.29
RES_CV  (via drill 0.25)
  Top 0.254: R22.1 5.4,40.32 12.7,33.02 20.32,33.02 36.83,33.02 R59.S | U4.3 38.61,62.57 38.61,61.72 39.37,60.96 v39.37,55.88
  Bottom 0.254: R59.S v39.37,55.88
SCK  (via drill 0.25)
  Top 0.254: v54.61,13.97 54.61,12.38 R6.2 57.19,9.88 Q1.3 | U2.17 55.62,23.87 v54.61,22.86
  Bottom 0.254: v54.61,13.97 v54.61,22.86 53.34,22.86 50.8,25.4 50.8,27.94 J1.3
THEREMIN_OUT  (via drill 0.25)
  Top 0.254: R46.1 29.53,86.36 v31.75,86.36
  Bottom 0.254: v31.75,86.36 36.83,86.36 JP9.2
VIN
  Top 1: U1.3 12.93,101.83 TP1.TP | TP1.TP 12.95,99.06 13.34,98.68 14.93,98.68 C1.1 | D1.C 8.89,100.33 TP1.TP
XTAL1  (via drill 0.25)
  Top 0.254: C7.1 51.75,44.45 X1.1 54.86,40.89 v55.63,40.13 | v55.63,35.03 U2.8
  Bottom 0.254: v55.63,40.13 v55.63,35.03
XTAL2  (via drill 0.25)
  Top 0.254: C8.1 67.63,44.45 X1.2 60.2,40.13 v56.39,40.13 | v56.39,35.03 56.39,33.53 U2.7
  Bottom 0.254: v56.39,40.13 v56.39,35.03

### Text on the board
bPlace: Rev. 00 | Team 18 | /Users/andrewforsman/Desktop/Theremizer_logo.bmp